# Altium project S7CAS-PLEIADES-CARTE-MERE_P01.PrjPcb (part 2 of 4)

## Sheet S7CAS-PLEIADES-CARTE-MERE_P01_CNA.SchDoc
size Tabloid; DocumentNumber: 6; SheetNumber: 6; SheetTotal: 17; Sheet_Name: CNA; Size: 11x17
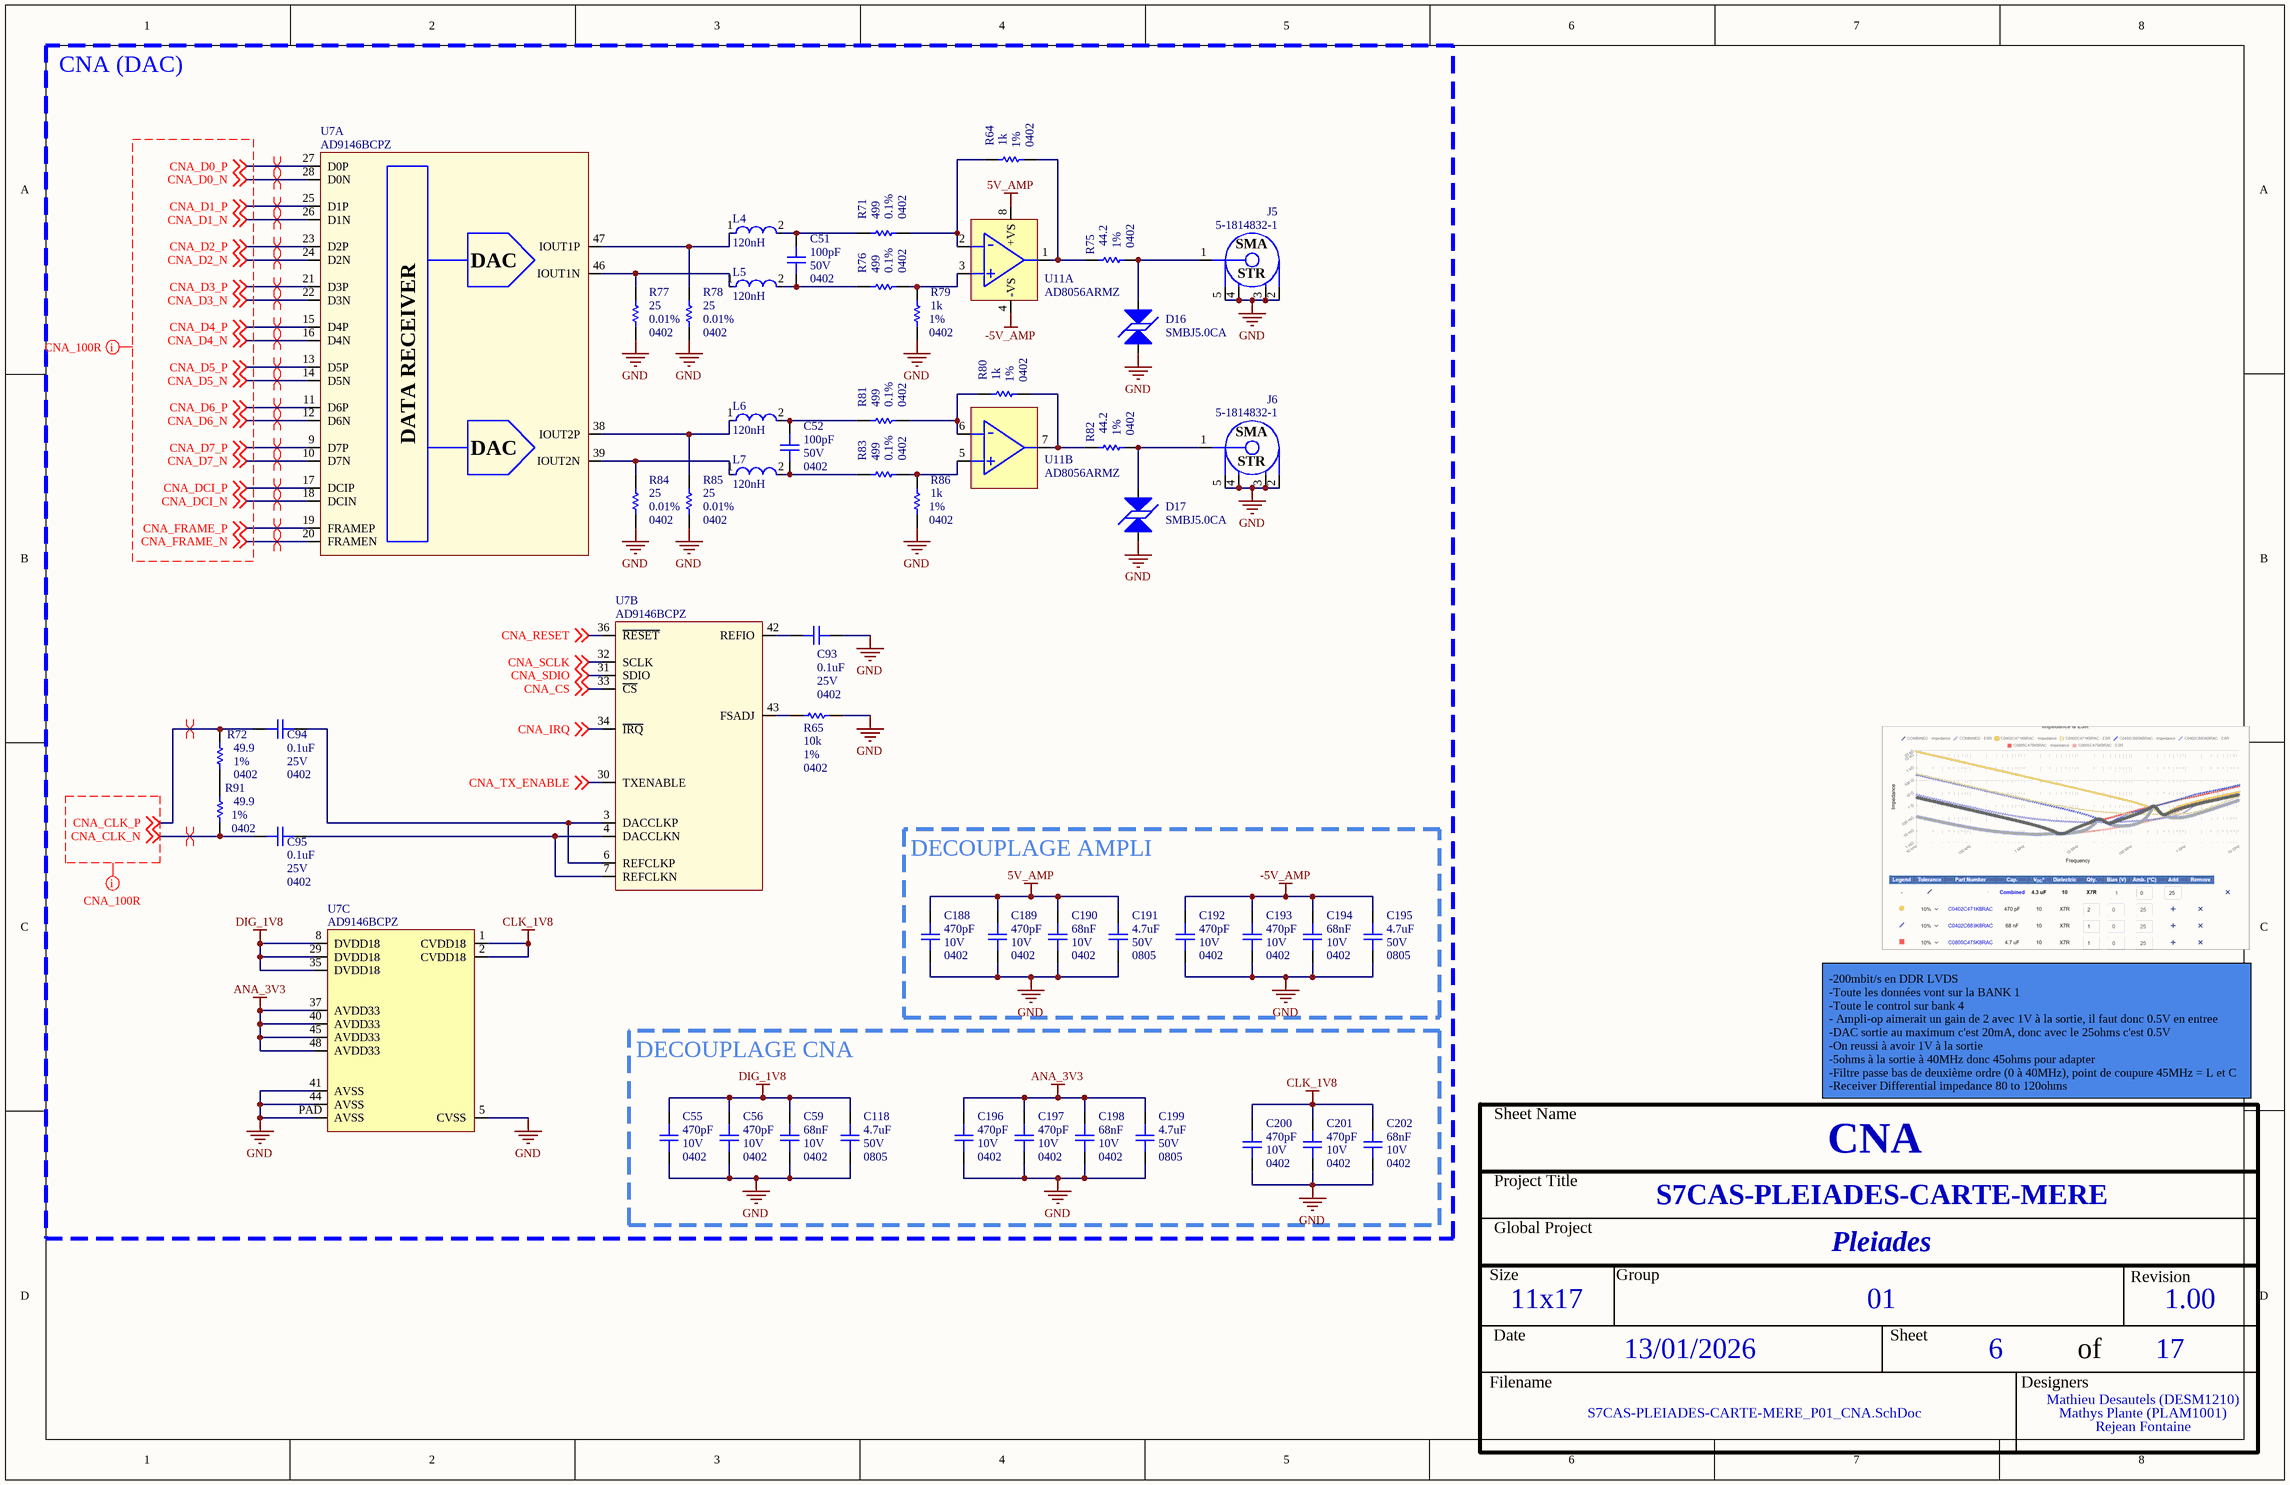
[diagram p5: S7CAS-PLEIADES-CARTE-MERE_P01_CNA.SchDoc]

### Parts
C51  value 100pF  Voltage: 50V  Package: 0402  [CAP_0402]  (hidden comment: CAP - 0402)
C52  value 100pF  Voltage: 50V  Package: 0402  [CAP_0402]  (hidden comment: CAP - 0402)
C55  value 470pF  Voltage: 10V  Package: 0402  [CAP_0402]  (hidden comment: CAP - 0402)
C56  value 470pF  Voltage: 10V  Package: 0402  [CAP_0402]  (hidden comment: CAP - 0402)
C59  value 68nF  Voltage: 10V  Package: 0402  [CAP_0402]  (hidden comment: CAP - 0402)
C93  value 0.1uF  Voltage: 25V  Package: 0402  [CAP_0402]  (hidden comment: CAP - 0402)
C94  value 0.1uF  Voltage: 25V  Package: 0402  [CAP_0402]  (hidden comment: CAP - 0402)
C95  value 0.1uF  Voltage: 25V  Package: 0402  [CAP_0402]  (hidden comment: CAP - 0402)
C118  value 4.7uF  Voltage: 50V  Package: 0805  [CAP_0805]  (hidden comment: CAP - 0805)
C188  value 470pF  Voltage: 10V  Package: 0402  [CAP_0402]  (hidden comment: CAP - 0402)
C189  value 470pF  Voltage: 10V  Package: 0402  [CAP_0402]  (hidden comment: CAP - 0402)
C190  value 68nF  Voltage: 10V  Package: 0402  [CAP_0402]  (hidden comment: CAP - 0402)
C191  value 4.7uF  Voltage: 50V  Package: 0805  [CAP_0805]  (hidden comment: CAP - 0805)
C192  value 470pF  Voltage: 10V  Package: 0402  [CAP_0402]  (hidden comment: CAP - 0402)
C193  value 470pF  Voltage: 10V  Package: 0402  [CAP_0402]  (hidden comment: CAP - 0402)
C194  value 68nF  Voltage: 10V  Package: 0402  [CAP_0402]  (hidden comment: CAP - 0402)
C195  value 4.7uF  Voltage: 50V  Package: 0805  [CAP_0805]  (hidden comment: CAP - 0805)
C196  value 470pF  Voltage: 10V  Package: 0402  [CAP_0402]  (hidden comment: CAP - 0402)
C197  value 470pF  Voltage: 10V  Package: 0402  [CAP_0402]  (hidden comment: CAP - 0402)
C198  value 68nF  Voltage: 10V  Package: 0402  [CAP_0402]  (hidden comment: CAP - 0402)
C199  value 4.7uF  Voltage: 50V  Package: 0805  [CAP_0805]  (hidden comment: CAP - 0805)
C200  value 470pF  Voltage: 10V  Package: 0402  [CAP_0402]  (hidden comment: CAP - 0402)
C201  value 470pF  Voltage: 10V  Package: 0402  [CAP_0402]  (hidden comment: CAP - 0402)
C202  value 68nF  Voltage: 10V  Package: 0402  [CAP_0402]  (hidden comment: CAP - 0402)
D16  SMBJ5.0CA  [TVS_PWR_SMBJ5.0CA]
D17  SMBJ5.0CA  [TVS_PWR_SMBJ5.0CA]
J5  5-1814832-1  [CONN_SMA_5-1814832-1]
J6  5-1814832-1  [CONN_SMA_5-1814832-1]
L4  120nH  [FP-0603HP-MFG]
L5  120nH  [FP-0603HP-MFG]
L6  120nH  [FP-0603HP-MFG]
L7  120nH  [FP-0603HP-MFG]
R64  value 1k  Package: 0402  Precision: 1%  [RES_0402]  (hidden comment: RES - 0402)
R65  value 10k  Package: 0402  Precision: 1%  [RES_0402]  (hidden comment: RES - 0402)
R71  value 499  Package: 0402  Precision: 0.1%  [RES_0402]  (hidden comment: RES - 0402)
R72  value 49.9  Package: 0402  Precision: 1%  [RES_0402]  (hidden comment: RES - 0402)
R75  value 44.2  Package: 0402  Precision: 1%  [RES_0402]  (hidden comment: RES - 0402)
R76  value 499  Package: 0402  Precision: 0.1%  [RES_0402]  (hidden comment: RES - 0402)
R77  value 25  Package: 0402  Precision: 0.01%  [RES_0402]  (hidden comment: RES - 0402)
R78  value 25  Package: 0402  Precision: 0.01%  [RES_0402]  (hidden comment: RES - 0402)
R79  value 1k  Package: 0402  Precision: 1%  [RES_0402]  (hidden comment: RES - 0402)
R80  value 1k  Package: 0402  Precision: 1%  [RES_0402]  (hidden comment: RES - 0402)
R81  value 499  Package: 0402  Precision: 0.1%  [RES_0402]  (hidden comment: RES - 0402)
R82  value 44.2  Package: 0402  Precision: 1%  [RES_0402]  (hidden comment: RES - 0402)
R83  value 499  Package: 0402  Precision: 0.1%  [RES_0402]  (hidden comment: RES - 0402)
R84  value 25  Package: 0402  Precision: 0.01%  [RES_0402]  (hidden comment: RES - 0402)
R85  value 25  Package: 0402  Precision: 0.01%  [RES_0402]  (hidden comment: RES - 0402)
R86  value 1k  Package: 0402  Precision: 1%  [RES_0402]  (hidden comment: RES - 0402)
R91  value 49.9  Package: 0402  Precision: 1%  [RES_0402]  (hidden comment: RES - 0402)
U7  AD9146BCPZ  [DAC_AD9146BCPZ]  (parts A,B,C of 3)
U11  AD8056ARMZ  [OPAMP_AD8056ARMZ]  (parts A,B of 2)

### Blocks framed on the sheet
CNA (DAC): C51 C52 C93-C95 D16 D17 J5 J6 L4-L7 R64 R65 R71 R72 R75-R86 R91 U7 U11
DECOUPLAGE AMPLI: C188-C195
DECOUPLAGE CNA: C55 C56 C59 C118 C196-C202

### Nets
5V_AMP: C188.2 C189.2 C190.2 C191.2 U11.8(+VS)
-5V_AMP: C192.2 C193.2 C194.2 C195.2 U11.4(-VS)
ANA_3V3: C196.2 C197.2 C198.2 C199.2 U7.37(AVDD33) U7.40(AVDD33) U7.45(AVDD33) U7.48(AVDD33)
CLK_1V8: C55.2 C56.2 C59.2 C118.2 C200.2 C201.2 C202.2 U7.1(CVDD18) U7.2(CVDD18) U7.8(DVDD18) U7.29(DVDD18) U7.35(DVDD18)  [also labelled DIG_1V8]
GND: C55.1 C56.1 C59.1 C93.1 C118.1 C188.1 C189.1 C190.1 C191.1 C192.1 C193.1 C194.1 C195.1 C196.1 C197.1 C198.1 C199.1 C200.1 C201.1 C202.1 D16.2 D17.2 J5.2 J5.3 J5.4 J5.5 J6.2 J6.3 J6.4 J6.5 R65.2 R77.1 R78.1 R79.1 R84.1 R85.1 R86.1 U7.5(CVSS) U7.41(AVSS) U7.44(AVSS) U7.PAD(AVSS)
CNA_CLK_N: C95.2 R91.1 ; off-sheet CNA_CLK_N
CNA_CLK_P: C94.2 R72.2 ; off-sheet CNA_CLK_P
CNA_CS: U7.33(~{CS}) ; off-sheet CNA_CS
CNA_D0_N: U7.28(D0N) ; off-sheet CNA_D0_N
CNA_D0_P: U7.27(D0P) ; off-sheet CNA_D0_P
CNA_D1_N: U7.26(D1N) ; off-sheet CNA_D1_N
CNA_D1_P: U7.25(D1P) ; off-sheet CNA_D1_P
CNA_D2_N: U7.24(D2N) ; off-sheet CNA_D2_N
CNA_D2_P: U7.23(D2P) ; off-sheet CNA_D2_P
CNA_D3_N: U7.22(D3N) ; off-sheet CNA_D3_N
CNA_D3_P: U7.21(D3P) ; off-sheet CNA_D3_P
CNA_D4_N: U7.16(D4N) ; off-sheet CNA_D4_N
CNA_D4_P: U7.15(D4P) ; off-sheet CNA_D4_P
CNA_D5_N: U7.14(D5N) ; off-sheet CNA_D5_N
CNA_D5_P: U7.13(D5P) ; off-sheet CNA_D5_P
CNA_D6_N: U7.12(D6N) ; off-sheet CNA_D6_N
CNA_D6_P: U7.11(D6P) ; off-sheet CNA_D6_P
CNA_D7_N: U7.10(D7N) ; off-sheet CNA_D7_N
CNA_D7_P: U7.9(D7P) ; off-sheet CNA_D7_P
CNA_DCI_N: U7.18(DCIN) ; off-sheet CNA_DCI_N
CNA_DCI_P: U7.17(DCIP) ; off-sheet CNA_DCI_P
CNA_FRAME_N: U7.20(FRAMEN) ; off-sheet CNA_FRAME_N
CNA_FRAME_P: U7.19(FRAMEP) ; off-sheet CNA_FRAME_P
CNA_IRQ: U7.34(~{IRQ}) ; off-sheet CNA_IRQ
CNA_RESET: U7.36(~{RESET}) ; off-sheet CNA_RESET
CNA_SCLK: U7.32(SCLK) ; off-sheet CNA_SCLK
CNA_SDIO: U7.31(SDIO) ; off-sheet CNA_SDIO
CNA_TX_ENABLE: U7.30(TXENABLE) ; off-sheet CNA_TX_ENABLE
NetC51_1: C51.1 L5.2 R76.2
NetC51_2: C51.2 L4.2 R71.2
NetC52_1: C52.1 L7.2 R83.2
NetC52_2: C52.2 L6.2 R81.2
NetC93_2: C93.2 U7.42(REFIO)
NetC94_1: C94.1 U7.3(DACCLKP) U7.6(REFCLKP)
NetC95_1: C95.1 U7.4(DACCLKN) U7.7(REFCLKN)
NetD16_1: D16.1 J5.1 R75.1
NetD17_1: D17.1 J6.1 R82.1
NetL4_1: L4.1 R78.2 U7.47(IOUT1P)
NetL5_1: L5.1 R77.2 U7.46(IOUT1N)
NetL6_1: L6.1 R85.2 U7.38(IOUT2P)
NetL7_1: L7.1 R84.2 U7.39(IOUT2N)
NetR64_1: R64.1 R75.2 U11.1(OUT1)
NetR64_2: R64.2 R71.1 U11.2(-IN1)
NetR65_1: R65.1 U7.43(FSADJ)
NetR72_1: R72.1 R91.2
NetR76_1: R76.1 R79.2 U11.3(+IN1)
NetR80_1: R80.1 R82.2 U11.7(OUT2)
NetR80_2: R80.2 R81.1 U11.6(-IN2)
NetR83_1: R83.1 R86.2 U11.5(+IN2)

### Layout directives
net class CNA_100R: CNA_CLK_N, CNA_CLK_P, CNA_D0_N, CNA_D0_P, CNA_D1_N, CNA_D1_P, CNA_D2_N, CNA_D2_P, CNA_D3_N, CNA_D3_P, CNA_D4_N, CNA_D4_P, CNA_D5_N, CNA_D5_P, CNA_D6_N, CNA_D6_P, CNA_D7_N, CNA_D7_P, CNA_DCI_N, CNA_DCI_P, CNA_FRAME_N, CNA_FRAME_P
differential pair: CNA_CLK_N, CNA_CLK_P, CNA_D0_N, CNA_D0_P, CNA_D1_N, CNA_D1_P, CNA_D2_N, CNA_D2_P, CNA_D3_N, CNA_D3_P, CNA_D4_N, CNA_D4_P, CNA_D5_N, CNA_D5_P, CNA_D6_N, CNA_D6_P, CNA_D7_N, CNA_D7_P, CNA_DCI_N, CNA_DCI_P, CNA_FRAME_N, CNA_FRAME_P

### Notes on the sheet
- -200mbit/s en DDR LVDS
  -Toute les données vont sur la BANK 1
  -Toute le control sur bank 4
  - Ampli-op aimerait un gain de 2 avec 1V à la sortie, il faut donc 0.5V en entree
  -DAC sortie au maximum c'est 20mA, donc avec le 25ohms c'est 0.5V
  -On reussi à avoir 1V à la sortie
  -5ohms à la sortie à 40MHz donc 45ohms pour adapter
  -Filtre passe bas de deuxième ordre (0 à 40MHz), point de coupure 45MHz = L et C
  -Receiver Differential impedance 80 to 120ohms
- Sheet Name
- Project Title
- Global Project
- Size
- Group
- Revision
- Date
- Sheet
- of
- Filename
- Designers
- (in symbol CONN_SMA_5-1814832-1) SMA; STR
- (in symbol DAC_AD9146BCPZ, part A) DAC; DATA RECEIVER

### Library data of the parts
C51 C52 = CAP - 0402: 100 pF ±5% 50V Ceramic Capacitor C0G, NP0 0603 (1608 Metric); Mfg Part Number: GRM1885C1H101JA01D; Mfg: Murata Electronics; Current: *; CreatedBy: Jonathan Bouchard; Power: *; Precision: 5%
C55 C56 C188 C189 C192 C193 C196 C197 C200 C201 = CAP - 0402: Mfg Part Number: C0402C471K8RACAUTO; Precision: 10%; Current: *; CreatedBy: Jonathan Bouchard; Power: *
C59 C190 C194 C198 C202 = CAP - 0402: Mfg Part Number: C0402C683K8RAC; Precision: 10%; Current: *; CreatedBy: Jonathan Bouchard; Power: *
C93-C95 = CAP - 0402: 0.1 µF ±10% 25V Ceramic Capacitor X7R 0402 (1005 Metric); Mfg Part Number: CL05B104KA5NNNC; Mfg: Samsung Electro-Mechanics; Current: *; CreatedBy: Jonathan Bouchard; Power: *; Precision: 10%; Part Number #1: CL05B104KA5NNNC
C118 C191 C195 C199 = CAP - 0805: as C81 on sheet S7CAS-PLEIADES-CARTE-MERE_P01_ALIM; Current: *; CreatedBy: Jonathan Bouchard; Power: *; Precision: 10%
D16 D17 = TVS_PWR_SMBJ5.0CA: TVS - BIDIR 5V 9.2V 600W - DO214AA; Manufacturer #1: Littelfuse Inc.; Value: Vbr = 6.4V -  Clamp = 9.2V; Voltage Rating: 5V Standoff; Current Rating: 65.3 A (Ipp); Power Max: 600W (Pppm); GRAMS Lib Spec: 2.8; Magnetic Material: UNKNOWN; Polarized: NO; Tolerance: *; HelpURL: http://www.littelfuse.com/~/media/electronics/datasheets/tvs_diodes/littelfuse_tvs_diode_smbj_datasheet.pdf.pdf; CreatedBy/Date: Jonathan Bouchard - 2019-03-22; VerifiedBy: Nicolas V. (2019-05-06); Temperature: -65°C ~ 150°C (TJ); Package: DO214AA; Manufacturer #2: *; Note: *; Assembly Type: SMD; Part Number #2: *; Part Number #1: SMBJ5.0CA; Supplier 1: Digi-Key; Supplier Part Number 1: SMBJ5.0CALFCT-ND; Cryo: UNKNOWN
J5 J6 = CONN_SMA_5-1814832-1: CONN -  SMA JACK STR 50 OHM - TH; Mfg: TE Connectivity AMP Connectors; Voltage: *; Current: *; Power: *; Mfg Part Number: 5-1814832-1; HelpURL: http://www.te.com/commerce/DocumentDelivery/DDEController?Action=srchrtrv&DocNm=1814832&DocType=Customer+Drawing&DocLang=English; CreatedBy: Jonathan Bouchard; Temperature: -65°C ~ 165°C; Value: *; Precision: *; Package: TH-5; Supplier 1: Digikey; Supplier Part Number 1: A97594-ND
L4-L7 = CMP-11268-000221-1: High Q Ceramic Chip Inductors 3.3nH 5% 0.024Ohm 1900mA 0603; DC Resistance (DCR): 24mR; Test Frequency: 250MHz; Max DC Current: 1.9A; Q Factor: 104; Self Resonant Frequency: 9.6GHz; Inductance: 3.3nH; Core Material: Ceramic; Height: 0.94mm; RoHS Compliant: Yes; Width: 1.09mm; Package Quantity: 2000; Termination: SMD/SMT; Series: 0603HP; Length: 1.75mm; Lead Free: Contains Lead; Packaging: Tape and Reel; Tolerance: 5%; Min Operating Temperature: -40°C; Max Operating Temperature: 125°C; Case/Package: 0603
R64 R79 R80 R86 = RES - 0402: as R108 on sheet S7CAS-PLEIADES-CARTE-MERE_P01_CLOCK; Current: *; CreatedBy: Jonathan Bouchard; Power: 1/10W; Part Number #1: ERJ-2RKF1001X
R65 = RES - 0402: as R53 on sheet S7CAS-PLEIADES-CARTE-MERE_P01_ALIM; Current: *; CreatedBy: Jonathan Bouchard; Power: 1/16W; Part Number #1: RMCF0402FT10K0
R71 R76 R81 R83 = RES - 0402: 499 Ohms ±0.1% 0.063W, 1/16W Chip Resistor 0402 (1005 Metric) Automotive AEC-Q200 Thin Film; Mfg Part Number: ERA-2AEB4990X; Voltage: TBD; Mfg: Panasonic Electronic Components; Current: *; CreatedBy: Jonathan Bouchard; Power: 1/16W
R72 R91 = RES - 0402: 49.9 Ohms ±1% 0.1W, 1/10W Chip Resistor 0402 (1005 Metric) Automotive AEC-Q200 Thick Film; Mfg Part Number: CRCW040249R9FKED; Voltage: 75V; Mfg: Vishay Dale; Current: *; CreatedBy: Jonathan Bouchard; Power: 1/10W; Part Number #1: CRCW040249R9FKED
R75 R82 = RES - 0402: 44.2 Ohms ±1% 0.1W, 1/10W Chip Resistor 0402 (1005 Metric) Automotive AEC-Q200 Thick Film; Mfg Part Number: ERJ-2RKF44R2X; Voltage: TBD; Mfg: Panasonic Electronic Components; Current: *; CreatedBy: Jonathan Bouchard; Power: 1/10W
R77 R78 R84 R85 = RES - 0402: 25 Ohms ±0.1% 0.05W, 1/20W Chip Resistor 0402 (1005 Metric) RF, High Frequency Thin Film; Mfg Part Number: FC0402E25R0BTT0; Voltage: TBD; Mfg: Vishay Dale Thin Film; Current: *; CreatedBy: Jonathan Bouchard; Power: 1/20W
U7 = DAC_AD9146BCPZ: DAC - 16BIT SRL HIGH SPEED - QFN-48; Voltage: 3.13 V ~ 3.47 V / 1.71 V ~ 1.89 V; Mfg: Analog Devices Inc.; Current: *; Power: *; Mfg Part Number: AD9146BCPZ; HelpURL: http://www.analog.com/media/en/technical-documentation/data-sheets/AD9146.PDF; CreatedBy: Jonathan Bouchard; Temperature: -40°C ~ 85°C; Value: *; Precision: 16 Bit; Package: QFN-48; Supplier 1: Digikey; Supplier Part Number 1: AD9146BCPZ-ND
U11 = OPAMP_AD8056ARMZ: OPAMP - VFB 300MHZ - 8MSOP; Voltage: 8 V ~ 12 V, ±4 V ~ 6 V; Current: 60mA; Mfg: Analog Devices; Power: *; Mfg Part Number: AD8056ARMZ; HelpURL: http://www.analog.com/media/en/technical-documentation/data-sheets/AD8055_8056.pdf; CreatedBy: Jonathan Bouchard; Temperature: -40°C ~ 125°C; Value: *; Precision: *; Package: MSOP-8; Supplier 1: Digikey; Supplier Part Number 1: AD8056ARMZ-REEL7CT-ND

## Sheet S7CAS-PLEIADES-CARTE-MERE_P01_CAN.SchDoc
size Tabloid; DocumentNumber: 7; SheetNumber: 7; SheetTotal: 17; Sheet_Name: CAN; Size: 11x17
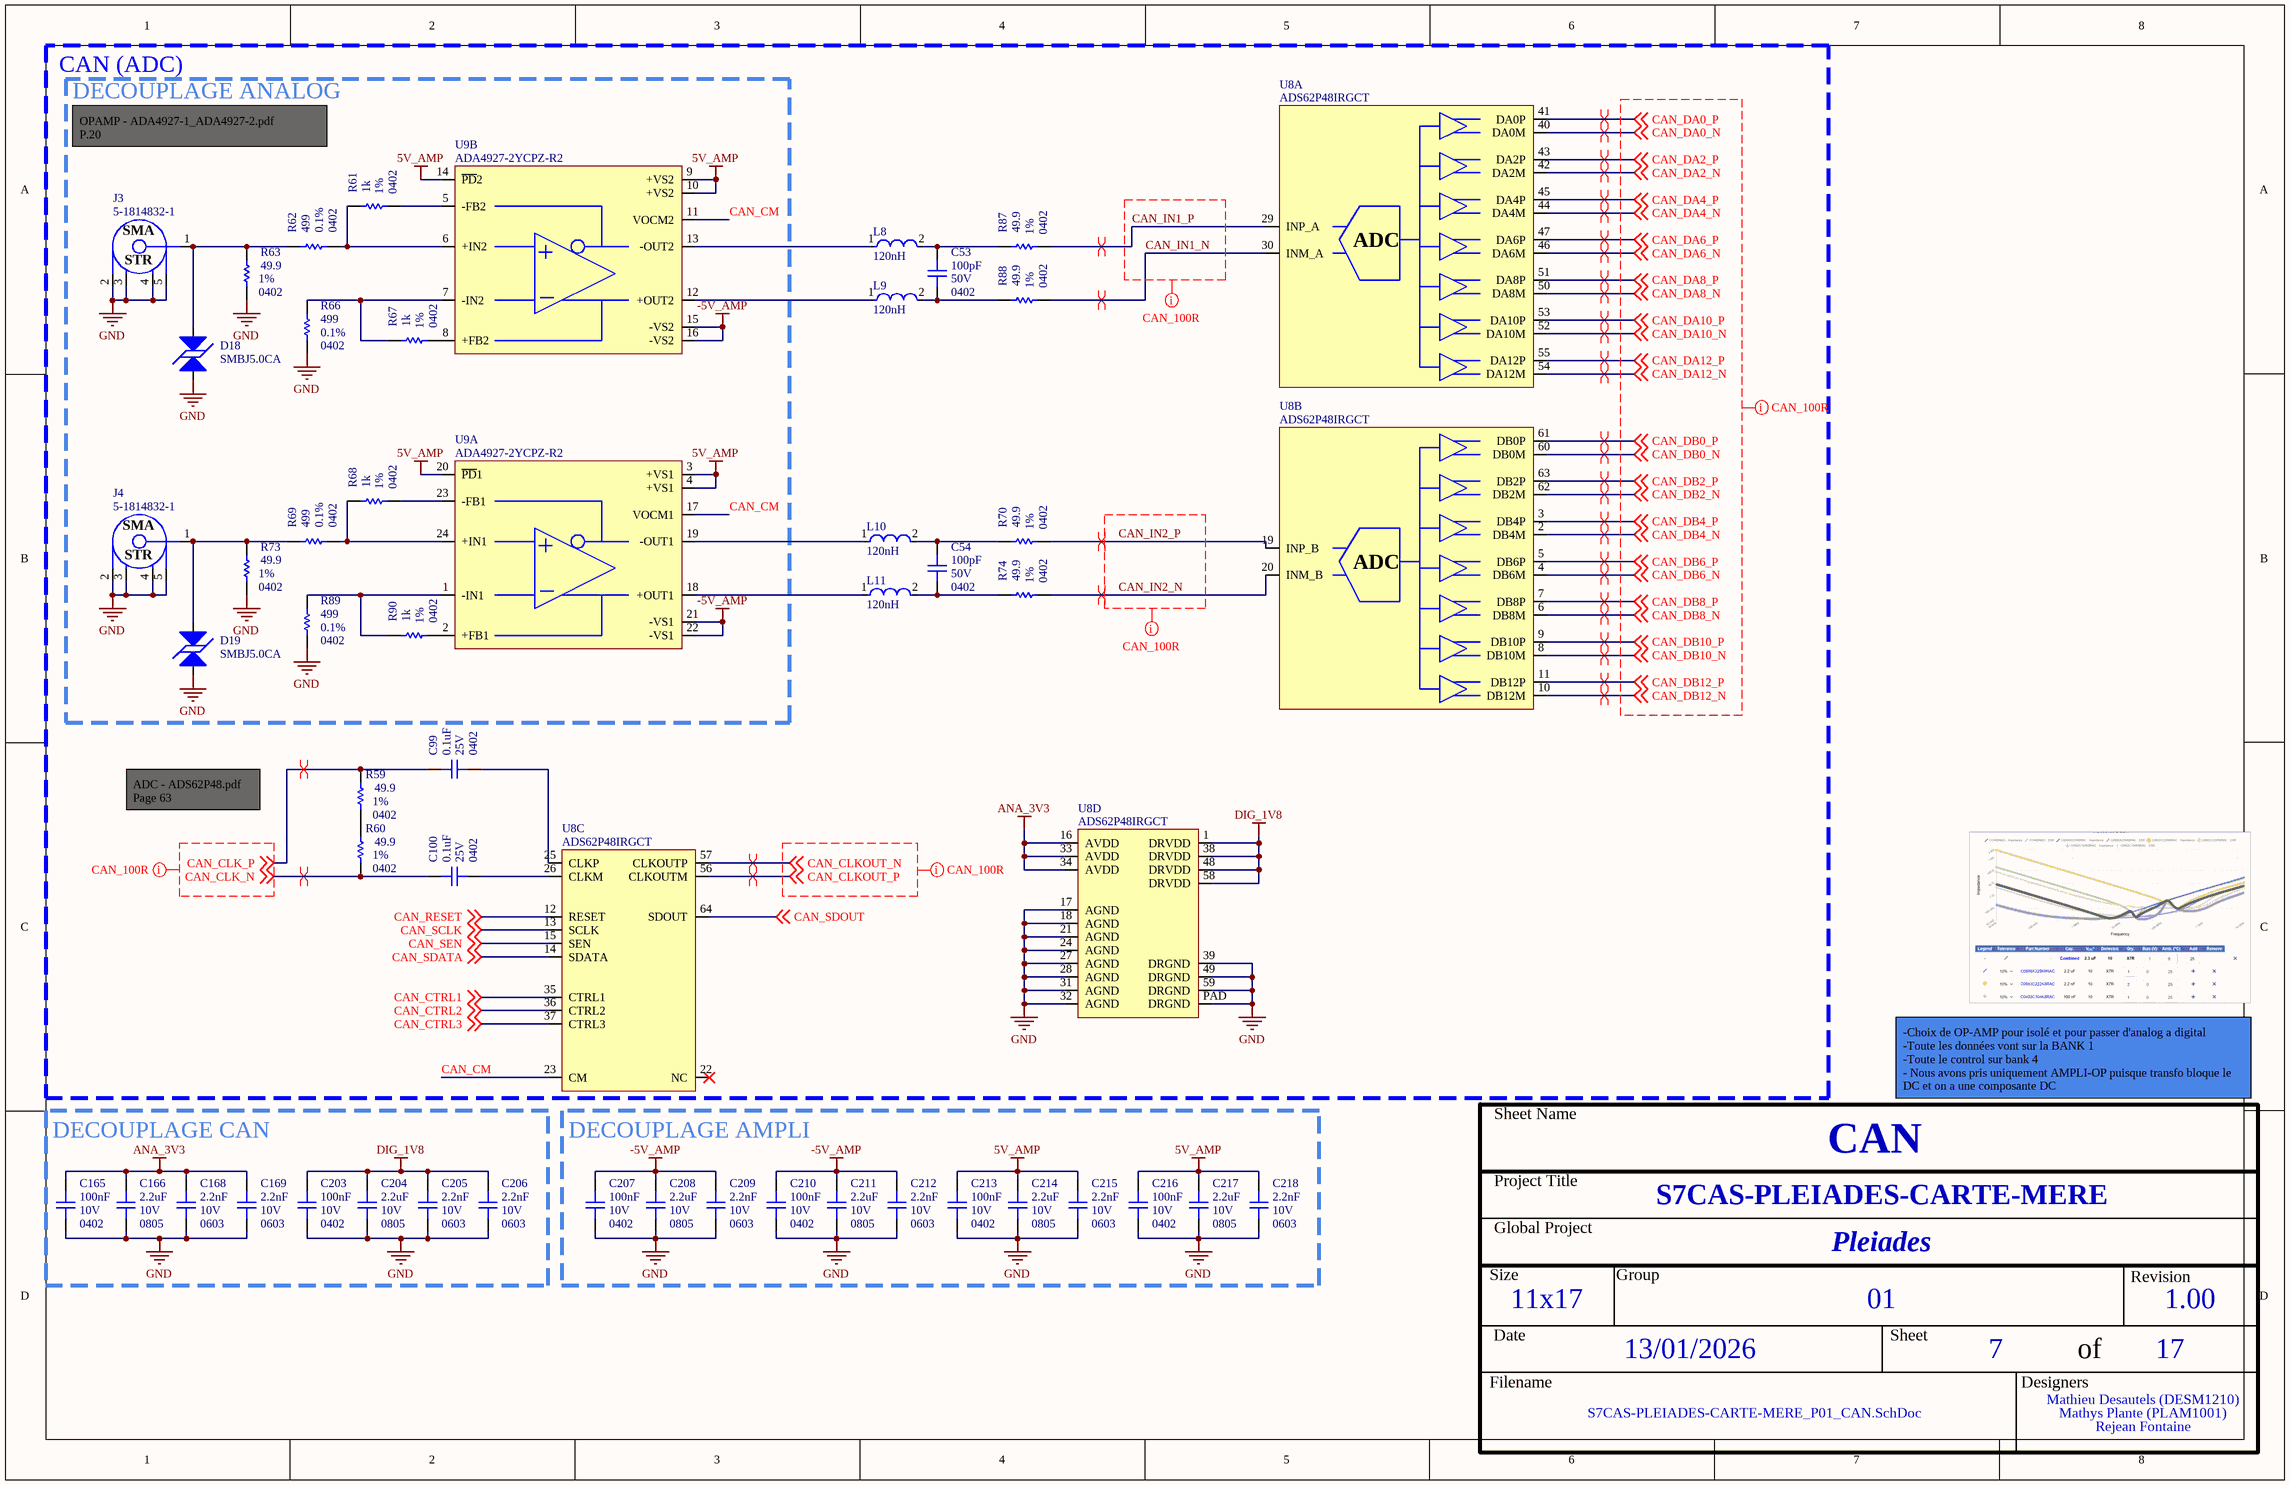
[diagram p6: S7CAS-PLEIADES-CARTE-MERE_P01_CAN.SchDoc]

### Parts
C53  value 100pF  Voltage: 50V  Package: 0402  [CAP_0402]  (hidden comment: CAP - 0402)
C54  value 100pF  Voltage: 50V  Package: 0402  [CAP_0402]  (hidden comment: CAP - 0402)
C99  value 0.1uF  Voltage: 25V  Package: 0402  [CAP_0402]  (hidden comment: CAP - 0402)
C100  value 0.1uF  Voltage: 25V  Package: 0402  [CAP_0402]  (hidden comment: CAP - 0402)
C165  value 100nF  Voltage: 10V  Package: 0402  [CAP_0402]  (hidden comment: CAP - 0402)
C166  value 2.2uF  Voltage: 10V  Package: 0805  [CAP_0805]  (hidden comment: CAP - 0805)
C168  value 2.2nF  Voltage: 10V  Package: 0603  [CAP_0603]  (hidden comment: CAP - 0603)
C169  value 2.2nF  Voltage: 10V  Package: 0603  [CAP_0603]  (hidden comment: CAP - 0603)
C203  value 100nF  Voltage: 10V  Package: 0402  [CAP_0402]  (hidden comment: CAP - 0402)
C204  value 2.2uF  Voltage: 10V  Package: 0805  [CAP_0805]  (hidden comment: CAP - 0805)
C205  value 2.2nF  Voltage: 10V  Package: 0603  [CAP_0603]  (hidden comment: CAP - 0603)
C206  value 2.2nF  Voltage: 10V  Package: 0603  [CAP_0603]  (hidden comment: CAP - 0603)
C207  value 100nF  Voltage: 10V  Package: 0402  [CAP_0402]  (hidden comment: CAP - 0402)
C208  value 2.2uF  Voltage: 10V  Package: 0805  [CAP_0805]  (hidden comment: CAP - 0805)
C209  value 2.2nF  Voltage: 10V  Package: 0603  [CAP_0603]  (hidden comment: CAP - 0603)
C210  value 100nF  Voltage: 10V  Package: 0402  [CAP_0402]  (hidden comment: CAP - 0402)
C211  value 2.2uF  Voltage: 10V  Package: 0805  [CAP_0805]  (hidden comment: CAP - 0805)
C212  value 2.2nF  Voltage: 10V  Package: 0603  [CAP_0603]  (hidden comment: CAP - 0603)
C213  value 100nF  Voltage: 10V  Package: 0402  [CAP_0402]  (hidden comment: CAP - 0402)
C214  value 2.2uF  Voltage: 10V  Package: 0805  [CAP_0805]  (hidden comment: CAP - 0805)
C215  value 2.2nF  Voltage: 10V  Package: 0603  [CAP_0603]  (hidden comment: CAP - 0603)
C216  value 100nF  Voltage: 10V  Package: 0402  [CAP_0402]  (hidden comment: CAP - 0402)
C217  value 2.2uF  Voltage: 10V  Package: 0805  [CAP_0805]  (hidden comment: CAP - 0805)
C218  value 2.2nF  Voltage: 10V  Package: 0603  [CAP_0603]  (hidden comment: CAP - 0603)
D18  SMBJ5.0CA  [TVS_PWR_SMBJ5.0CA]
D19  SMBJ5.0CA  [TVS_PWR_SMBJ5.0CA]
J3  5-1814832-1  [CONN_SMA_5-1814832-1]
J4  5-1814832-1  [CONN_SMA_5-1814832-1]
L8  120nH  [FP-0603HP-MFG]
L9  120nH  [FP-0603HP-MFG]
L10  120nH  [FP-0603HP-MFG]
L11  120nH  [FP-0603HP-MFG]
R59  value 49.9  Package: 0402  Precision: 1%  [RES_0402]  (hidden comment: RES - 0402)
R60  value 49.9  Package: 0402  Precision: 1%  [RES_0402]  (hidden comment: RES - 0402)
R61  value 1k  Package: 0402  Precision: 1%  [RES_0402]  (hidden comment: RES - 0402)
R62  value 499  Package: 0402  Precision: 0.1%  [RES_0402]  (hidden comment: RES - 0402)
R63  value 49.9  Package: 0402  Precision: 1%  [RES_0402]  (hidden comment: RES - 0402)
R66  value 499  Package: 0402  Precision: 0.1%  [RES_0402]  (hidden comment: RES - 0402)
R67  value 1k  Package: 0402  Precision: 1%  [RES_0402]  (hidden comment: RES - 0402)
R68  value 1k  Package: 0402  Precision: 1%  [RES_0402]  (hidden comment: RES - 0402)
R69  value 499  Package: 0402  Precision: 0.1%  [RES_0402]  (hidden comment: RES - 0402)
R70  value 49.9  Package: 0402  Precision: 1%  [RES_0402]  (hidden comment: RES - 0402)
R73  value 49.9  Package: 0402  Precision: 1%  [RES_0402]  (hidden comment: RES - 0402)
R74  value 49.9  Package: 0402  Precision: 1%  [RES_0402]  (hidden comment: RES - 0402)
R87  value 49.9  Package: 0402  Precision: 1%  [RES_0402]  (hidden comment: RES - 0402)
R88  value 49.9  Package: 0402  Precision: 1%  [RES_0402]  (hidden comment: RES - 0402)
R89  value 499  Package: 0402  Precision: 0.1%  [RES_0402]  (hidden comment: RES - 0402)
R90  value 1k  Package: 0402  Precision: 1%  [RES_0402]  (hidden comment: RES - 0402)
U8  ADS62P48IRGCT  [ADC_ADS62P48IRGCT]  (parts A,B,C,D of 4)
U9  ADA4927-2YCPZ-R2  [OPAMP_ADA4927-2YCPZ-R2]  (parts A,B of 2)

### Blocks framed on the sheet
CAN (ADC): C53 C54 C99 C100 L8-L11 R59 R60 R70 R74 R87 R88 U8
DECOUPLAGE ANALOG: D18 D19 J3 J4 R61-R63 R66-R69 R73 R89 R90 U9
DECOUPLAGE CAN: C165 C166 C168 C169 C203-C206
DECOUPLAGE AMPLI: C207-C218

### Nets
5V_AMP: C213.2 C214.2 C215.2 C216.2 C217.2 C218.2 U9.3(+VS1) U9.4(+VS1) U9.9(+VS2) U9.10(+VS2) U9.14(~{PD}2) U9.20(~{PD}1)
-5V_AMP: C207.2 C208.2 C209.2 C210.2 C211.2 C212.2 U9.15(-VS2) U9.16(-VS2) U9.21(-VS1) U9.22(-VS1)
ANA_3V3: C165.2 C166.2 C168.2 C169.2 U8.16(AVDD) U8.33(AVDD) U8.34(AVDD)
DIG_1V8: C203.2 C204.2 C205.2 C206.2 U8.1(DRVDD) U8.38(DRVDD) U8.48(DRVDD) U8.58(DRVDD)  [project net CLK_1V8]
GND: C165.1 C166.1 C168.1 C169.1 C203.1 C204.1 C205.1 C206.1 C207.1 C208.1 C209.1 C210.1 C211.1 C212.1 C213.1 C214.1 C215.1 C216.1 C217.1 C218.1 D18.2 D19.2 J3.2 J3.3 J3.4 J3.5 J4.2 J4.3 J4.4 J4.5 R63.1 R66.1 R73.1 R89.1 U8.17(AGND) U8.18(AGND) U8.21(AGND) U8.24(AGND) U8.27(AGND) U8.28(AGND) U8.31(AGND) U8.32(AGND) U8.39(DRGND) U8.49(DRGND) U8.59(DRGND) U8.PAD(DRGND)
CAN_CLK_N: C100.2 R60.1 ; off-sheet CAN_CLK_N
CAN_CLK_P: C99.2 R59.2 ; off-sheet CAN_CLK_P
CAN_CLKOUT_N: U8.57(CLKOUTP) ; off-sheet CAN_CLKOUT_N
CAN_CLKOUT_P: U8.56(CLKOUTM) ; off-sheet CAN_CLKOUT_P
CAN_CM: U8.23(CM) U9.11(VOCM2) U9.17(VOCM1)
CAN_CTRL1: U8.35(CTRL1) ; off-sheet CAN_CTRL1
CAN_CTRL2: U8.36(CTRL2) ; off-sheet CAN_CTRL2
CAN_CTRL3: U8.37(CTRL3) ; off-sheet CAN_CTRL3
CAN_DA0_N: U8.40(DA0M) ; off-sheet CAN_DA0_N
CAN_DA0_P: U8.41(DA0P) ; off-sheet CAN_DA0_P
CAN_DA2_N: U8.42(DA2M) ; off-sheet CAN_DA2_N
CAN_DA2_P: U8.43(DA2P) ; off-sheet CAN_DA2_P
CAN_DA4_N: U8.44(DA4M) ; off-sheet CAN_DA4_N
CAN_DA4_P: U8.45(DA4P) ; off-sheet CAN_DA4_P
CAN_DA6_N: U8.46(DA6M) ; off-sheet CAN_DA6_N
CAN_DA6_P: U8.47(DA6P) ; off-sheet CAN_DA6_P
CAN_DA8_N: U8.50(DA8M) ; off-sheet CAN_DA8_N
CAN_DA8_P: U8.51(DA8P) ; off-sheet CAN_DA8_P
CAN_DA10_N: U8.52(DA10M) ; off-sheet CAN_DA10_N
CAN_DA10_P: U8.53(DA10P) ; off-sheet CAN_DA10_P
CAN_DA12_N: U8.54(DA12M) ; off-sheet CAN_DA12_N
CAN_DA12_P: U8.55(DA12P) ; off-sheet CAN_DA12_P
CAN_DB0_N: U8.60(DB0M) ; off-sheet CAN_DB0_N
CAN_DB0_P: U8.61(DB0P) ; off-sheet CAN_DB0_P
CAN_DB2_N: U8.62(DB2M) ; off-sheet CAN_DB2_N
CAN_DB2_P: U8.63(DB2P) ; off-sheet CAN_DB2_P
CAN_DB4_N: U8.2(DB4M) ; off-sheet CAN_DB4_N
CAN_DB4_P: U8.3(DB4P) ; off-sheet CAN_DB4_P
CAN_DB6_N: U8.4(DB6M) ; off-sheet CAN_DB6_N
CAN_DB6_P: U8.5(DB6P) ; off-sheet CAN_DB6_P
CAN_DB8_N: U8.6(DB8M) ; off-sheet CAN_DB8_N
CAN_DB8_P: U8.7(DB8P) ; off-sheet CAN_DB8_P
CAN_DB10_N: U8.8(DB10M) ; off-sheet CAN_DB10_N
CAN_DB10_P: U8.9(DB10P) ; off-sheet CAN_DB10_P
CAN_DB12_N: U8.10(DB12M) ; off-sheet CAN_DB12_N
CAN_DB12_P: U8.11(DB12P) ; off-sheet CAN_DB12_P
CAN_IN1_N: R88.1 U8.30(INM_A)
CAN_IN1_P: R87.1 U8.29(INP_A)
CAN_IN2_N: R74.1 U8.20(INM_B)
CAN_IN2_P: R70.1 U8.19(INP_B)
CAN_RESET: U8.12(RESET) ; off-sheet CAN_RESET
CAN_SCLK: U8.13(SCLK) ; off-sheet CAN_SCLK
CAN_SDATA: U8.14(SDATA) ; off-sheet CAN_SDATA
CAN_SDOUT: U8.64(SDOUT) ; off-sheet CAN_SDOUT
CAN_SEN: U8.15(SEN) ; off-sheet CAN_SEN
NetC53_1: C53.1 L9.2 R88.2
NetC53_2: C53.2 L8.2 R87.2
NetC54_1: C54.1 L11.2 R74.2
NetC54_2: C54.2 L10.2 R70.2
NetC99_1: C99.1 U8.25(CLKP)
NetC100_1: C100.1 U8.26(CLKM)
NetD18_1: D18.1 J3.1 R62.2 R63.2
NetD19_1: D19.1 J4.1 R69.2 R73.2
NetL8_1: L8.1 U9.13(-OUT2)
NetL9_1: L9.1 U9.12(+OUT2)
NetL10_1: L10.1 U9.19(-OUT1)
NetL11_1: L11.1 U9.18(+OUT1)
NetR59_1: R59.1 R60.2
NetR61_1: R61.1 U9.5(-FB2)
NetR61_2: R61.2 R62.1 U9.6(+IN2)
NetR66_2: R66.2 R67.2 U9.7(-IN2)
NetR67_1: R67.1 U9.8(+FB2)
NetR68_1: R68.1 U9.23(-FB1)
NetR68_2: R68.2 R69.1 U9.24(+IN1)
NetR89_2: R89.2 R90.2 U9.1(-IN1)
NetR90_1: R90.1 U9.2(+FB1)

Not connected (* = marked no-connect by the designer): U8 22(NC)*

### Layout directives
net class CAN_100R: CAN_CLK_N, CAN_CLK_P, CAN_CLKOUT_N, CAN_CLKOUT_P, CAN_DA0_N, CAN_DA0_P, CAN_DA2_N, CAN_DA2_P, CAN_DA4_N, CAN_DA4_P, CAN_DA6_N, CAN_DA6_P, CAN_DA8_N, CAN_DA8_P, CAN_DA10_N, CAN_DA10_P, CAN_DA12_N, CAN_DA12_P, CAN_DB0_N, CAN_DB0_P, CAN_DB2_N, CAN_DB2_P, CAN_DB4_N, CAN_DB4_P, CAN_DB6_N, CAN_DB6_P, CAN_DB8_N, CAN_DB8_P, CAN_DB10_N, CAN_DB10_P, CAN_DB12_N, CAN_DB12_P, CAN_IN1_N, CAN_IN1_P, CAN_IN2_N, CAN_IN2_P
differential pair: CAN_CLK_N, CAN_CLK_P, CAN_CLKOUT_N, CAN_CLKOUT_P, CAN_DA0_N, CAN_DA0_P, CAN_DA2_N, CAN_DA2_P, CAN_DA4_N, CAN_DA4_P, CAN_DA6_N, CAN_DA6_P, CAN_DA8_N, CAN_DA8_P, CAN_DA10_N, CAN_DA10_P, CAN_DA12_N, CAN_DA12_P, CAN_DB0_N, CAN_DB0_P, CAN_DB2_N, CAN_DB2_P, CAN_DB4_N, CAN_DB4_P, CAN_DB6_N, CAN_DB6_P, CAN_DB8_N, CAN_DB8_P, CAN_DB10_N, CAN_DB10_P, CAN_DB12_N, CAN_DB12_P, CAN_IN1_N, CAN_IN1_P, CAN_IN2_N, CAN_IN2_P

### Notes on the sheet
- OPAMP - ADA4927-1_ADA4927-2.pdf
  P.20
- ADC - ADS62P48.pdf
  Page 63
- -Choix de OP-AMP pour isolé et pour passer d'analog a digital
  -Toute les données vont sur la BANK 1
  -Toute le control sur bank 4
  - Nous avons pris uniquement AMPLI-OP puisque transfo bloque le DC et on a une composante DC
- Sheet Name
- Project Title
- Global Project
- Size
- Group
- Revision
- Date
- Sheet
- of
- Filename
- Designers
- (in symbol ADC_ADS62P48IRGCT, part A) ADC
- (in symbol ADC_ADS62P48IRGCT, part B) ADC
- (in symbol CONN_SMA_5-1814832-1) SMA; STR

### Library data of the parts
C53 C54 = CAP - 0402: 100 pF ±5% 50V Ceramic Capacitor C0G, NP0 0603 (1608 Metric); Mfg Part Number: GRM1885C1H101JA01D; Mfg: Murata Electronics; Current: *; CreatedBy: Jonathan Bouchard; Power: *; Precision: 5%
C99 C100 = CAP - 0402: 0.1 µF ±10% 25V Ceramic Capacitor X7R 0402 (1005 Metric); Mfg Part Number: CL05B104KA5NNNC; Mfg: Samsung Electro-Mechanics; Current: *; CreatedBy: Jonathan Bouchard; Power: *; Precision: 10%; Part Number #1: CL05B104KA5NNNC
C165 C203 C207 C210 C213 C216 = CAP - 0402: Mfg Part Number: C0402C104K8RAC; Precision: 10%; Current: *; CreatedBy: Jonathan Bouchard; Power: *
C166 C204 C208 C211 C214 C217 = CAP - 0805: Mfg Part Number: C0805C225K8RAC; Precision: 10%; Current: *; CreatedBy: Jonathan Bouchard; Power: *
C168 C169 C205 C206 C209 C212 C215 C218 = CAP - 0603: Mfg Part Number: C0603X222K8RAC; Precision: 10%; Current: *; CreatedBy: Jonathan Bouchard; Power: *
D18 D19 = TVS_PWR_SMBJ5.0CA: TVS - BIDIR 5V 9.2V 600W - DO214AA; Manufacturer #1: Littelfuse Inc.; Value: Vbr = 6.4V -  Clamp = 9.2V; Voltage Rating: 5V Standoff; Current Rating: 65.3 A (Ipp); Power Max: 600W (Pppm); GRAMS Lib Spec: 2.8; Magnetic Material: UNKNOWN; Polarized: NO; Tolerance: *; HelpURL: http://www.littelfuse.com/~/media/electronics/datasheets/tvs_diodes/littelfuse_tvs_diode_smbj_datasheet.pdf.pdf; CreatedBy/Date: Jonathan Bouchard - 2019-03-22; VerifiedBy: Nicolas V. (2019-05-06); Temperature: -65°C ~ 150°C (TJ); Package: DO214AA; Manufacturer #2: *; Note: *; Assembly Type: SMD; Part Number #2: *; Part Number #1: SMBJ5.0CA; Supplier 1: Digi-Key; Supplier Part Number 1: SMBJ5.0CALFCT-ND; Cryo: UNKNOWN
J3 J4 = CONN_SMA_5-1814832-1: CONN -  SMA JACK STR 50 OHM - TH; Mfg: TE Connectivity AMP Connectors; Voltage: *; Current: *; Power: *; Mfg Part Number: 5-1814832-1; HelpURL: http://www.te.com/commerce/DocumentDelivery/DDEController?Action=srchrtrv&DocNm=1814832&DocType=Customer+Drawing&DocLang=English; CreatedBy: Jonathan Bouchard; Temperature: -65°C ~ 165°C; Value: *; Precision: *; Package: TH-5; Supplier 1: Digikey; Supplier Part Number 1: A97594-ND
L8-L11 = CMP-11268-000221-1: High Q Ceramic Chip Inductors 3.3nH 5% 0.024Ohm 1900mA 0603; DC Resistance (DCR): 24mR; Test Frequency: 250MHz; Max DC Current: 1.9A; Q Factor: 104; Self Resonant Frequency: 9.6GHz; Inductance: 3.3nH; Core Material: Ceramic; Height: 0.94mm; RoHS Compliant: Yes; Width: 1.09mm; Package Quantity: 2000; Termination: SMD/SMT; Series: 0603HP; Length: 1.75mm; Lead Free: Contains Lead; Packaging: Tape and Reel; Tolerance: 5%; Min Operating Temperature: -40°C; Max Operating Temperature: 125°C; Case/Package: 0603
R59 R60 R63 R70 R73 R74 R87 R88 = RES - 0402: 49.9 Ohms ±1% 0.1W, 1/10W Chip Resistor 0402 (1005 Metric) Automotive AEC-Q200 Thick Film; Mfg Part Number: CRCW040249R9FKED; Voltage: 75V; Mfg: Vishay Dale; Current: *; CreatedBy: Jonathan Bouchard; Power: 1/10W; Part Number #1: CRCW040249R9FKED
R61 R67 R68 R90 = RES - 0402: 1 kOhms ±1% 0.1W, 1/10W Chip Resistor 0402 (1005 Metric) Automotive AEC-Q200 Thick Film; Mfg Part Number: ERJ-2RKF1001X; Voltage: 50V; Mfg: Panasonic Electronic Components; Current: *; CreatedBy: Jonathan Bouchard; Power: 1/10W; Part Number #1: ERJ-2RKF1001X
R62 R66 R69 R89 = RES - 0402: 499 Ohms ±0.1% 0.063W, 1/16W Chip Resistor 0402 (1005 Metric) Automotive AEC-Q200 Thin Film; Mfg Part Number: ERA-2AEB4990X; Voltage: TBD; Mfg: Panasonic Electronic Components; Current: *; CreatedBy: Jonathan Bouchard; Power: 1/16W
U8 = ADC_ADS62P48IRGCT: ADC - 14 BIT 210MSPS SUAL - VQFN-64; Voltage: 3.15 V ~ 3.6 V / 1.7 V ~ 1.9 V; Mfg: Texas Instruments; Precision: 14 Bit; Current: *; Power: *; Mfg Part Number: ADS62P48IRGCT; HelpURL: http://www.ti.com/lit/ds/symlink/ads62p48.pdf; CreatedBy: Jonathan Bouchard; Temperature: -40°C ~ 85°C; Value: *; Package: VQFN-64; Supplier 1: Digikey; Supplier Part Number 1: 296-24611-1-ND
U9 = OPAMP_ADA4927-2YCPZ-R2: OPAMP - CFA 2.3GHZ - QFN-24; Voltage: 4.5 V ~ 11 V, ±2.25 V ~ 5.5 V; Current: 65mA; Mfg: Analog Devices; Power: *; Mfg Part Number: ADA4927-2YCPZ-R2; HelpURL: http://www.analog.com/media/en/technical-documentation/data-sheets/ADA4927-1_4927-2.pdf; CreatedBy: Jonathan Bouchard; Temperature: -40°C ~ 105°C; Value: *; Precision: *; Package: QFN-24; Supplier 1: Digikey; Supplier Part Number 1: ADA4927-2YCPZ-R2CT-ND

## Sheet S7CAS-PLEIADES-CARTE-MERE_P01_DDR3.SchDoc
size Tabloid; DocumentNumber: 8; SheetNumber: 8; SheetTotal: 17; Sheet_Name: DDR3; Size: 11x17
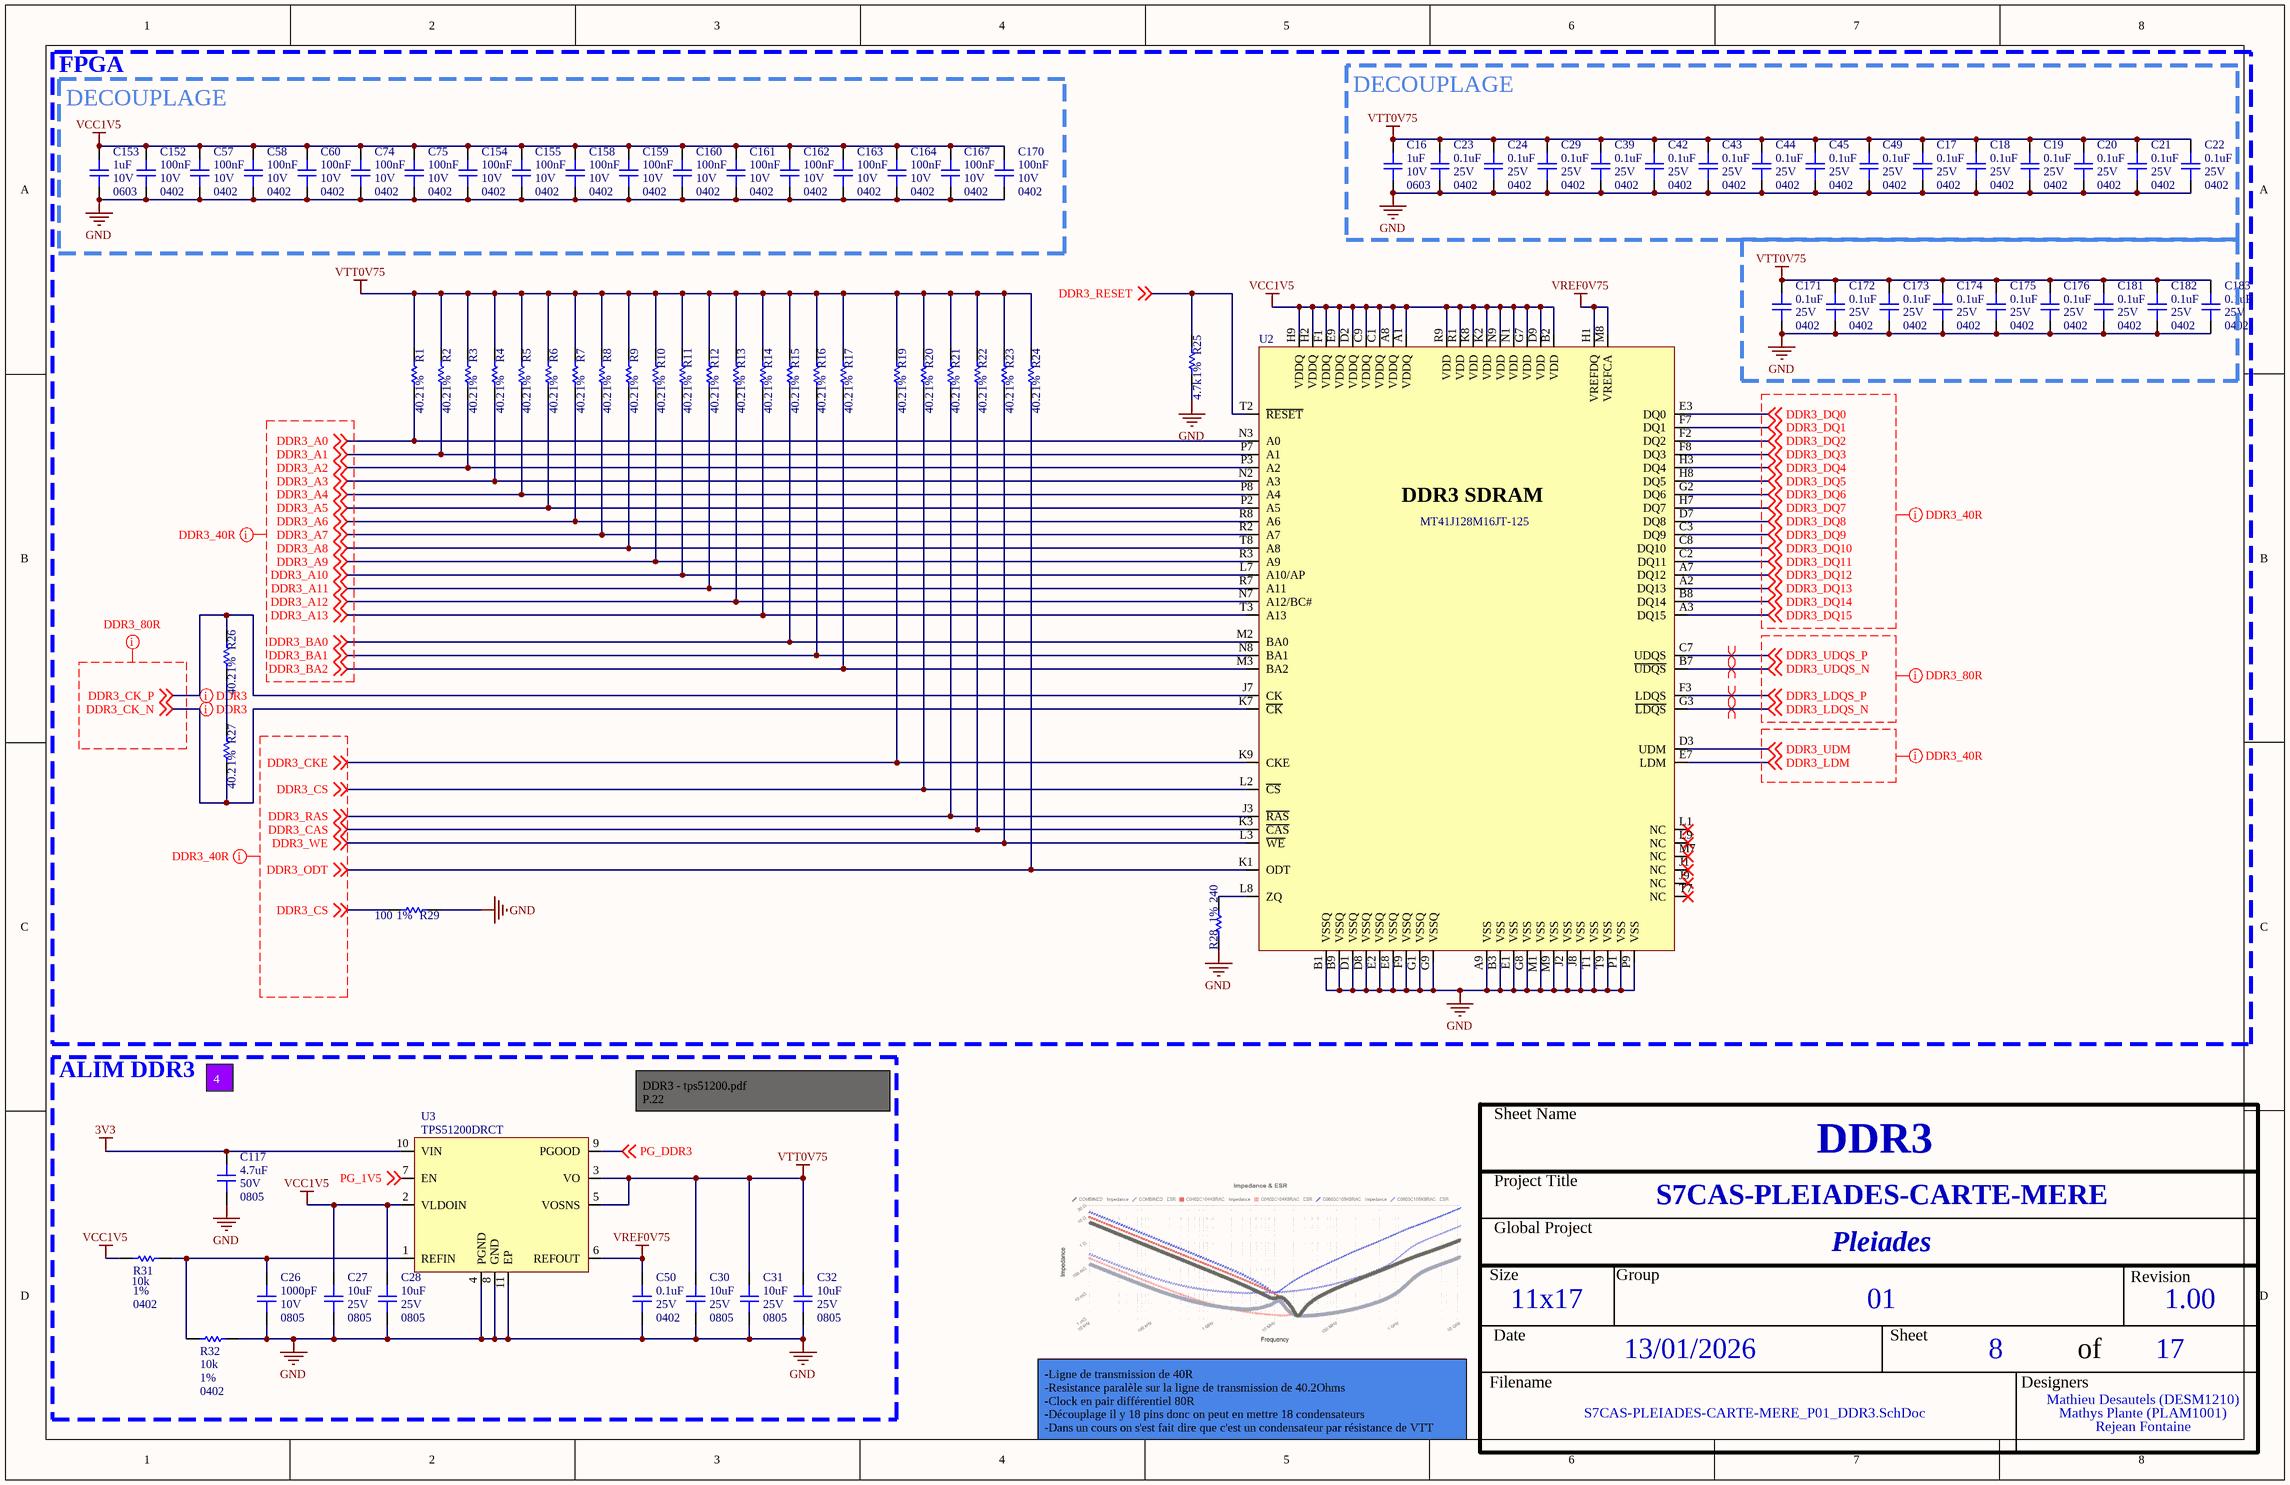
[diagram p7: S7CAS-PLEIADES-CARTE-MERE_P01_DDR3.SchDoc]

### Parts
C16  value 1uF  Voltage: 10V  Package: 0603  [CAP_0603]  (hidden comment: CAP - 0603)
C17  value 0.1uF  Voltage: 25V  Package: 0402  [CAP_0402]  (hidden comment: CAP - 0402)
C18  value 0.1uF  Voltage: 25V  Package: 0402  [CAP_0402]  (hidden comment: CAP - 0402)
C19  value 0.1uF  Voltage: 25V  Package: 0402  [CAP_0402]  (hidden comment: CAP - 0402)
C20  value 0.1uF  Voltage: 25V  Package: 0402  [CAP_0402]  (hidden comment: CAP - 0402)
C21  value 0.1uF  Voltage: 25V  Package: 0402  [CAP_0402]  (hidden comment: CAP - 0402)
C22  value 0.1uF  Voltage: 25V  Package: 0402  [CAP_0402]  (hidden comment: CAP - 0402)
C23  value 0.1uF  Voltage: 25V  Package: 0402  [CAP_0402]  (hidden comment: CAP - 0402)
C24  value 0.1uF  Voltage: 25V  Package: 0402  [CAP_0402]  (hidden comment: CAP - 0402)
C26  value 1000pF  Voltage: 10V  Package: 0805  [CAP_0805]  (hidden comment: CAP - 0805)
C27  value 10uF  Voltage: 25V  Package: 0805  [CAP_0805]  (hidden comment: CAP - 0805)
C28  value 10uF  Voltage: 25V  Package: 0805  [CAP_0805]  (hidden comment: CAP - 0805)
C29  value 0.1uF  Voltage: 25V  Package: 0402  [CAP_0402]  (hidden comment: CAP - 0402)
C30  value 10uF  Voltage: 25V  Package: 0805  [CAP_0805]  (hidden comment: CAP - 0805)
C31  value 10uF  Voltage: 25V  Package: 0805  [CAP_0805]  (hidden comment: CAP - 0805)
C32  value 10uF  Voltage: 25V  Package: 0805  [CAP_0805]  (hidden comment: CAP - 0805)
C39  value 0.1uF  Voltage: 25V  Package: 0402  [CAP_0402]  (hidden comment: CAP - 0402)
C42  value 0.1uF  Voltage: 25V  Package: 0402  [CAP_0402]  (hidden comment: CAP - 0402)
C43  value 0.1uF  Voltage: 25V  Package: 0402  [CAP_0402]  (hidden comment: CAP - 0402)
C44  value 0.1uF  Voltage: 25V  Package: 0402  [CAP_0402]  (hidden comment: CAP - 0402)
C45  value 0.1uF  Voltage: 25V  Package: 0402  [CAP_0402]  (hidden comment: CAP - 0402)
C49  value 0.1uF  Voltage: 25V  Package: 0402  [CAP_0402]  (hidden comment: CAP - 0402)
C50  value 0.1uF  Voltage: 25V  Package: 0402  [CAP_0402]  (hidden comment: CAP - 0402)
C57  value 100nF  Voltage: 10V  Package: 0402  [CAP_0402]  (hidden comment: CAP - 0402)
C58  value 100nF  Voltage: 10V  Package: 0402  [CAP_0402]  (hidden comment: CAP - 0402)
C60  value 100nF  Voltage: 10V  Package: 0402  [CAP_0402]  (hidden comment: CAP - 0402)
C74  value 100nF  Voltage: 10V  Package: 0402  [CAP_0402]  (hidden comment: CAP - 0402)
C75  value 100nF  Voltage: 10V  Package: 0402  [CAP_0402]  (hidden comment: CAP - 0402)
C117  value 4.7uF  Voltage: 50V  Package: 0805  [CAP_0805]  (hidden comment: CAP - 0805)
C152  value 100nF  Voltage: 10V  Package: 0402  [CAP_0402]  (hidden comment: CAP - 0402)
C153  value 1uF  Voltage: 10V  Package: 0603  [CAP_0603]  (hidden comment: CAP - 0603)
C154  value 100nF  Voltage: 10V  Package: 0402  [CAP_0402]  (hidden comment: CAP - 0402)
C155  value 100nF  Voltage: 10V  Package: 0402  [CAP_0402]  (hidden comment: CAP - 0402)
C158  value 100nF  Voltage: 10V  Package: 0402  [CAP_0402]  (hidden comment: CAP - 0402)
C159  value 100nF  Voltage: 10V  Package: 0402  [CAP_0402]  (hidden comment: CAP - 0402)
C160  value 100nF  Voltage: 10V  Package: 0402  [CAP_0402]  (hidden comment: CAP - 0402)
C161  value 100nF  Voltage: 10V  Package: 0402  [CAP_0402]  (hidden comment: CAP - 0402)
C162  value 100nF  Voltage: 10V  Package: 0402  [CAP_0402]  (hidden comment: CAP - 0402)
C163  value 100nF  Voltage: 10V  Package: 0402  [CAP_0402]  (hidden comment: CAP - 0402)
C164  value 100nF  Voltage: 10V  Package: 0402  [CAP_0402]  (hidden comment: CAP - 0402)
C167  value 100nF  Voltage: 10V  Package: 0402  [CAP_0402]  (hidden comment: CAP - 0402)
C170  value 100nF  Voltage: 10V  Package: 0402  [CAP_0402]  (hidden comment: CAP - 0402)
C171  value 0.1uF  Voltage: 25V  Package: 0402  [CAP_0402]  (hidden comment: CAP - 0402)
C172  value 0.1uF  Voltage: 25V  Package: 0402  [CAP_0402]  (hidden comment: CAP - 0402)
C173  value 0.1uF  Voltage: 25V  Package: 0402  [CAP_0402]  (hidden comment: CAP - 0402)
C174  value 0.1uF  Voltage: 25V  Package: 0402  [CAP_0402]  (hidden comment: CAP - 0402)
C175  value 0.1uF  Voltage: 25V  Package: 0402  [CAP_0402]  (hidden comment: CAP - 0402)
C176  value 0.1uF  Voltage: 25V  Package: 0402  [CAP_0402]  (hidden comment: CAP - 0402)
C181  value 0.1uF  Voltage: 25V  Package: 0402  [CAP_0402]  (hidden comment: CAP - 0402)
C182  value 0.1uF  Voltage: 25V  Package: 0402  [CAP_0402]  (hidden comment: CAP - 0402)
C183  value 0.1uF  Voltage: 25V  Package: 0402  [CAP_0402]  (hidden comment: CAP - 0402)
R1  value 40.2  Precision: 1%  [RES_0402]  (hidden comment: RES - 0402)
R2  value 40.2  Precision: 1%  [RES_0402]  (hidden comment: RES - 0402)
R3  value 40.2  Precision: 1%  [RES_0402]  (hidden comment: RES - 0402)
R4  value 40.2  Precision: 1%  [RES_0402]  (hidden comment: RES - 0402)
R5  value 40.2  Precision: 1%  [RES_0402]  (hidden comment: RES - 0402)
R6  value 40.2  Precision: 1%  [RES_0402]  (hidden comment: RES - 0402)
R7  value 40.2  Precision: 1%  [RES_0402]  (hidden comment: RES - 0402)
R8  value 40.2  Precision: 1%  [RES_0402]  (hidden comment: RES - 0402)
R9  value 40.2  Precision: 1%  [RES_0402]  (hidden comment: RES - 0402)
R10  value 40.2  Precision: 1%  [RES_0402]  (hidden comment: RES - 0402)
R11  value 40.2  Precision: 1%  [RES_0402]  (hidden comment: RES - 0402)
R12  value 40.2  Precision: 1%  [RES_0402]  (hidden comment: RES - 0402)
R13  value 40.2  Precision: 1%  [RES_0402]  (hidden comment: RES - 0402)
R14  value 40.2  Precision: 1%  [RES_0402]  (hidden comment: RES - 0402)
R15  value 40.2  Precision: 1%  [RES_0402]  (hidden comment: RES - 0402)
R16  value 40.2  Precision: 1%  [RES_0402]  (hidden comment: RES - 0402)
R17  value 40.2  Precision: 1%  [RES_0402]  (hidden comment: RES - 0402)
R19  value 40.2  Precision: 1%  [RES_0402]  (hidden comment: RES - 0402)
R20  value 40.2  Precision: 1%  [RES_0402]  (hidden comment: RES - 0402)
R21  value 40.2  Precision: 1%  [RES_0402]  (hidden comment: RES - 0402)
R22  value 40.2  Precision: 1%  [RES_0402]  (hidden comment: RES - 0402)
R23  value 40.2  Precision: 1%  [RES_0402]  (hidden comment: RES - 0402)
R24  value 40.2  Precision: 1%  [RES_0402]  (hidden comment: RES - 0402)
R25  value 4.7k  Precision: 1%  [RES_0402]  (hidden comment: RES - 0402)
R26  value 40.2  Precision: 1%  [RES_0402]  (hidden comment: RES - 0402)
R27  value 40.2  Precision: 1%  [RES_0402]  (hidden comment: RES - 0402)
R28  value 240  Precision: 1%  [RES_0402]  (hidden comment: RES - 0402)
R29  value 100  Precision: 1%  [RES_0402]  (hidden comment: RES - 0402)
R31  value 10k  Package: 0402  Precision: 1%  [RES_0402]  (hidden comment: RES - 0402)
R32  value 10k  Package: 0402  Precision: 1%  [RES_0402]  (hidden comment: RES - 0402)
U2  MT41J128M16JT-125  [MEM_DDR3_MT41J128M16JT-125]
U3  TPS51200DRCT  [REG_PMIC_TPS51200DRCT]

### Blocks framed on the sheet
DECOUPLAGE: C16-C24 C29 C39 C42-C45 C49
ALIM DDR3: C26-C28 C30-C32 C50 C117 R31 R32 U3

### Nets
3V3: C117.2 U3.10(VIN)  [project net VDD_3V3]
GND: C16.1 C17.1 C18.1 C19.1 C20.1 C21.1 C22.1 C23.1 C24.1 C26.1 C27.1 C28.1 C29.1 C30.1 C31.1 C32.1 C39.1 C42.1 C43.1 C44.1 C45.1 C49.1 C50.1 C57.1 C58.1 C60.1 C74.1 C75.1 C117.1 C152.1 C153.1 C154.1 C155.1 C158.1 C159.1 C160.1 C161.1 C162.1 C163.1 C164.1 C167.1 C170.1 C171.1 C172.1 C173.1 C174.1 C175.1 C176.1 C181.1 C182.1 C183.1 R25.1 R28.2 R29.2 R32.2 U2.A9(VSS) U2.B1(VSSQ) U2.B3(VSS) U2.B9(VSSQ) U2.D1(VSSQ) U2.D8(VSSQ) U2.E1(VSS) U2.E2(VSSQ) U2.E8(VSSQ) U2.F9(VSSQ) U2.G1(VSSQ) U2.G8(VSS) U2.G9(VSSQ) U2.J2(VSS) U2.J8(VSS) U2.M1(VSS) U2.M9(VSS) U2.P1(VSS) U2.P9(VSS) U2.T1(VSS) U2.T9(VSS) U3.4(PGND) U3.8(GND) U3.11(EP)
VCC1V5: C27.2 C28.2 C57.2 C58.2 C60.2 C74.2 C75.2 C152.2 C153.2 C154.2 C155.2 C158.2 C159.2 C160.2 C161.2 C162.2 C163.2 C164.2 C167.2 C170.2 R31.1 U2.A1(VDDQ) U2.A8(VDDQ) U2.B2(VDD) U2.C1(VDDQ) U2.C9(VDDQ) U2.D2(VDDQ) U2.D9(VDD) U2.E9(VDDQ) U2.F1(VDDQ) U2.G7(VDD) U2.H2(VDDQ) U2.H9(VDDQ) U2.K2(VDD) U2.K8(VDD) U2.N1(VDD) U2.N9(VDD) U2.R1(VDD) U2.R9(VDD) U3.2(VLDOIN)
VREF0V75: C50.2 U2.H1(VREFDQ) U2.M8(VREFCA) U3.6(REFOUT)
VTT0V75: C16.2 C17.2 C18.2 C19.2 C20.2 C21.2 C22.2 C23.2 C24.2 C29.2 C30.2 C31.2 C32.2 C39.2 C42.2 C43.2 C44.2 C45.2 C49.2 C171.2 C172.2 C173.2 C174.2 C175.2 C176.2 C181.2 C182.2 C183.2 R1.2 R2.2 R3.2 R4.2 R5.2 R6.2 R7.2 R8.2 R9.2 R10.2 R11.2 R12.2 R13.2 R14.2 R15.2 R16.2 R17.2 R19.2 R20.2 R21.2 R22.2 R23.2 R24.2 U3.3(VO) U3.5(VOSNS)
DDR3_A0: R1.1 U2.N3(A0) ; off-sheet DDR3_A0
DDR3_A1: R2.1 U2.P7(A1) ; off-sheet DDR3_A1
DDR3_A2: R3.1 U2.P3(A2) ; off-sheet DDR3_A2
DDR3_A3: R4.1 U2.N2(A3) ; off-sheet DDR3_A3
DDR3_A4: R5.1 U2.P8(A4) ; off-sheet DDR3_A4
DDR3_A5: R6.1 U2.P2(A5) ; off-sheet DDR3_A5
DDR3_A6: R7.1 U2.R8(A6) ; off-sheet DDR3_A6
DDR3_A7: R8.1 U2.R2(A7) ; off-sheet DDR3_A7
DDR3_A8: R9.1 U2.T8(A8) ; off-sheet DDR3_A8
DDR3_A9: R10.1 U2.R3(A9) ; off-sheet DDR3_A9
DDR3_A10: R11.1 U2.L7(A10/AP) ; off-sheet DDR3_A10
DDR3_A11: R12.1 U2.R7(A11) ; off-sheet DDR3_A11
DDR3_A12: R13.1 U2.N7(A12/BC#) ; off-sheet DDR3_A12
DDR3_A13: R14.1 U2.T3(A13) ; off-sheet DDR3_A13
DDR3_BA0: R15.1 U2.M2(BA0) ; off-sheet DDR3_BA0
DDR3_BA1: R16.1 U2.N8(BA1) ; off-sheet DDR3_BA1
DDR3_BA2: R17.1 U2.M3(BA2) ; off-sheet DDR3_BA2
DDR3_CAS: R22.1 U2.K3(~{CAS}) ; off-sheet DDR3_CAS
DDR3_CK_N: R27.1 U2.K7(~{CK}) ; off-sheet DDR3_CK_N
DDR3_CK_P: R26.2 U2.J7(CK) ; off-sheet DDR3_CK_P
DDR3_CKE: R19.1 U2.K9(CKE) ; off-sheet DDR3_CKE
DDR3_CS: R20.1 R29.1 U2.L2(~{CS}) ; off-sheet DDR3_CS
DDR3_DQ0: U2.E3(DQ0) ; off-sheet DDR3_DQ0
DDR3_DQ1: U2.F7(DQ1) ; off-sheet DDR3_DQ1
DDR3_DQ2: U2.F2(DQ2) ; off-sheet DDR3_DQ2
DDR3_DQ3: U2.F8(DQ3) ; off-sheet DDR3_DQ3
DDR3_DQ4: U2.H3(DQ4) ; off-sheet DDR3_DQ4
DDR3_DQ5: U2.H8(DQ5) ; off-sheet DDR3_DQ5
DDR3_DQ6: U2.G2(DQ6) ; off-sheet DDR3_DQ6
DDR3_DQ7: U2.H7(DQ7) ; off-sheet DDR3_DQ7
DDR3_DQ8: U2.D7(DQ8) ; off-sheet DDR3_DQ8
DDR3_DQ9: U2.C3(DQ9) ; off-sheet DDR3_DQ9
DDR3_DQ10: U2.C8(DQ10) ; off-sheet DDR3_DQ10
DDR3_DQ11: U2.C2(DQ11) ; off-sheet DDR3_DQ11
DDR3_DQ12: U2.A7(DQ12) ; off-sheet DDR3_DQ12
DDR3_DQ13: U2.A2(DQ13) ; off-sheet DDR3_DQ13
DDR3_DQ14: U2.B8(DQ14) ; off-sheet DDR3_DQ14
DDR3_DQ15: U2.A3(DQ15) ; off-sheet DDR3_DQ15
DDR3_LDM: U2.E7(LDM) ; off-sheet DDR3_LDM
DDR3_LDQS_N: U2.G3(~{LDQS}) ; off-sheet DDR3_LDQS_N
DDR3_LDQS_P: U2.F3(LDQS) ; off-sheet DDR3_LDQS_P
DDR3_ODT: R24.1 U2.K1(ODT) ; off-sheet DDR3_ODT
DDR3_RAS: R21.1 U2.J3(~{RAS}) ; off-sheet DDR3_RAS
DDR3_RESET: R25.2 U2.T2(~{RESET}) ; off-sheet DDR3_RESET
DDR3_UDM: U2.D3(UDM) ; off-sheet DDR3_UDM
DDR3_UDQS_N: U2.B7(~{UDQS}) ; off-sheet DDR3_UDQS_N
DDR3_UDQS_P: U2.C7(UDQS) ; off-sheet DDR3_UDQS_P
DDR3_WE: R23.1 U2.L3(~{WE}) ; off-sheet DDR3_WE
PG_1V5: U3.7(EN) ; off-sheet PG_1V5
PG_DDR3: U3.9(PGOOD) ; off-sheet PG_DDR3
NetC26_2: C26.2 R31.2 R32.1 U3.1(REFIN)
NetR26_1: R26.1 R27.2
NetR28_1: R28.1 U2.L8(ZQ)

Not connected (* = marked no-connect by the designer): U2 J1(NC)* J9(NC)* L1(NC)* L9(NC)* M7(NC)* T7(NC)*

### Layout directives
differential pair: DDR3_CK_N, DDR3_CK_P, DDR3_LDQS_N, DDR3_LDQS_P, DDR3_UDQS_N, DDR3_UDQS_P
net class DDR3_40R: DDR3_A0, DDR3_A1, DDR3_A2, DDR3_A3, DDR3_A4, DDR3_A5, DDR3_A6, DDR3_A7, DDR3_A8, DDR3_A9, DDR3_A10, DDR3_A11, DDR3_A12, DDR3_A13, DDR3_BA0, DDR3_BA1, DDR3_BA2, DDR3_CAS, DDR3_CKE, DDR3_CS, DDR3_DQ0, DDR3_DQ1, DDR3_DQ2, DDR3_DQ3, DDR3_DQ4, DDR3_DQ5, DDR3_DQ6, DDR3_DQ7, DDR3_DQ8, DDR3_DQ9, DDR3_DQ10, DDR3_DQ11, DDR3_DQ12, DDR3_DQ13, DDR3_DQ14, DDR3_DQ15, DDR3_LDM, DDR3_ODT, DDR3_RAS, DDR3_UDM, DDR3_WE
net class DDR3_80R: DDR3_CK_N, DDR3_CK_P, DDR3_LDQS_N, DDR3_LDQS_P, DDR3_UDQS_N, DDR3_UDQS_P

### Notes on the sheet
- FPGA
- DECOUPLAGE
- 4
- DDR3 - tps51200.pdf
  P.22
- -Ligne de transmission de 40R
  -Resistance paralèle sur la ligne de transmission de 40.2Ohms
  -Clock en pair différentiel 80R
  -Découplage il y 18 pins donc on peut en mettre 18 condensateurs
  -Dans un cours on s'est fait dire que c'est un condensateur par résistance de VTT
- Sheet Name
- Project Title
- Global Project
- Size
- Group
- Revision
- Date
- Sheet
- of
- Filename
- Designers
- (in symbol MEM_DDR3_MT41J128M16JT-125:K TR) DDR3 SDRAM

### Library data of the parts
C16 C153 = CAP - 0603: Mfg Part Number: C0603C105K8RAC; Precision: 10%; Current: *; CreatedBy: Jonathan Bouchard; Power: *
C17-C24 C29 C39 C42-C45 C49 C50 C171-C176 C181-C183 = CAP - 0402: as C99 on sheet S7CAS-PLEIADES-CARTE-MERE_P01_CAN; Current: *; CreatedBy: Jonathan Bouchard; Power: *; Precision: 10%; Part Number #1: CL05B104KA5NNNC
C26 = CAP - 0805: 1000 pF ±10% 10V Ceramic Capacitor X7R 0805 (2012 Metric); Mfg Part Number: C0805C102K8RACTU; Current: *; CreatedBy: Jonathan Bouchard; Power: *; Precision: 10%; Part Number #1: C0805C102K8RACTU
C27 C28 C30-C32 = CAP - 0805: 10 µF ±10% 25V Ceramic Capacitor X5R 0805 (2012 Metric); Mfg Part Number: CL21A106KAYNNNE; Mfg: Samsung Electro-Mechanics; Current: *; CreatedBy: Jonathan Bouchard; Power: *; Precision: 10%; Part Number #1: CL21A106KAYNNNE
C57 C58 C60 C74 C75 C152 C154 C155 C158-C164 C167 C170 = CAP - 0402: as C165 on sheet S7CAS-PLEIADES-CARTE-MERE_P01_CAN; Current: *; CreatedBy: Jonathan Bouchard; Power: *
C117 = CAP - 0805: 4.7 µF ±10% 50V Ceramic Capacitor X5R 0805 (2012 Metric); Mfg Part Number: GRT21BR61H475KE13L; Mfg: Murata Electronics; Current: *; CreatedBy: Jonathan Bouchard; Power: *; Precision: 10%
R1-R17 R19-R24 R26 R27 = RES - 0402: 40.2 Ohms ±1% 0.1W, 1/10W Chip Resistor 0402 (1005 Metric) Automotive AEC-Q200 Thick Film; Mfg Part Number: CRCW040240R2FKED; Voltage: 75V; Power: 1/16W; Current: *; CreatedBy: Jonathan Bouchard; Package: 0402; Part Number #1: CRCW040240R2FKED
R25 = RES - 0402: 4.7 kOhms ±1% 0.063W, 1/16W Chip Resistor 0402 (1005 Metric) Moisture Resistant Thick Film; Mfg Part Number: RC0402FR-074K7L; Voltage: 75V; Current: *; CreatedBy: Jonathan Bouchard; Power: 1/16W; Package: 0402; Part Number #1: RC0402FR-074K7L
R28 = RES - 0402: 240 Ohms ±1% 0.1W, 1/10W Chip Resistor 0402 (1005 Metric) Automotive AEC-Q200 Thick Film; Mfg Part Number: ERJ-2RKF2400X; Voltage: 50V; Current: *; CreatedBy: Jonathan Bouchard; Power: 1/10W; Package: 0402; Part Number #1: ERJ-2RKF2400X
R29 = RES - 0402: 100 Ohms ±1% 0.1W, 1/10W Chip Resistor 0402 (1005 Metric) Automotive AEC-Q200 Thick Film; Mfg Part Number: RK73H1ETTP1000F; Voltage: 75V; Current: *; CreatedBy: Jonathan Bouchard; Power: 1/10W; Package: 0402; Part Number #1: RK73H1ETTP1000F
R31 R32 = RES - 0402: 10 kOhms ±1% 0.063W, 1/16W Chip Resistor 0402 (1005 Metric) Automotive AEC-Q200 Thick Film; Mfg Part Number: RMCF0402FT10K0; Voltage: 75V; Current: *; CreatedBy: Jonathan Bouchard; Power: 1/16W; Part Number #1: RMCF0402FT10K0
U2 = MEM_DDR3_MT41J128M16JT-125:K TR: MEM - DDR3 SDRAM 2GBIT 800MHZ - TFBGA-96; Voltage: 1.425 V ~ 1.575 V; Mfg: Micrel; Current: *; Power: *; Mfg Part Number: MT41J128M16JT-125; HelpURL: http://www.micron.com/~/media/Documents/Products/Data%20Sheet/DRAM/DDR3/2Gb_DDR3_SDRAM.pdf; CreatedBy: Jonathan Bouchard; Temperature: 0°C ~ 95°C (TC); Value: *; Precision: *; Package: TFBGA-96; Supplier 1: Digikey; Supplier Part Number 1: 557-1611-1-ND; Part Number #1: MT41J128M16JT-125
U3 = REG_PMIC_TPS51200DRCT: REG - DDR TERMINATION/REF REG - 10-VFDFN; Manufacturer #1: Texas Instruments; Value: DDR, DDR2, DDR3(L), DDR4; Voltage Rating: 2.375V ~ 3.5V; Current Rating: Source: 3A~4.5A, Sink: 3.5A~5.5A; GRAMS Lib Spec: 2.8; Magnetic Material: Unknown; Polarized: Yes; Tolerance: *; Power Max: *; HelpURL: http://www.ti.com/lit/ds/symlink/tps51200.pdf; CreatedBy/Date: Joel Lemay 2019-03-19; VerifiedBy: Nicolas V. (2019-05-31); Temperature: -40°C ~ 85°C; Package: 10-VFDFN; Manufacturer #2: *; Part Number #2: *; Part Number #1: TPS51200DRCT; Supplier 1: Digi-Key; Supplier Part Number 1: 296-23830-1-ND; Cryo: UNKNOWN; Mfg Part Number: TPS51200DRCT

## Sheet S7CAS-PLEIADES-CARTE-MERE_P01_MOTORS.SchDoc
size Tabloid; DocumentNumber: 9; SheetNumber: 9; SheetTotal: 17; Sheet_Name: MOTORS; Size: 11x17
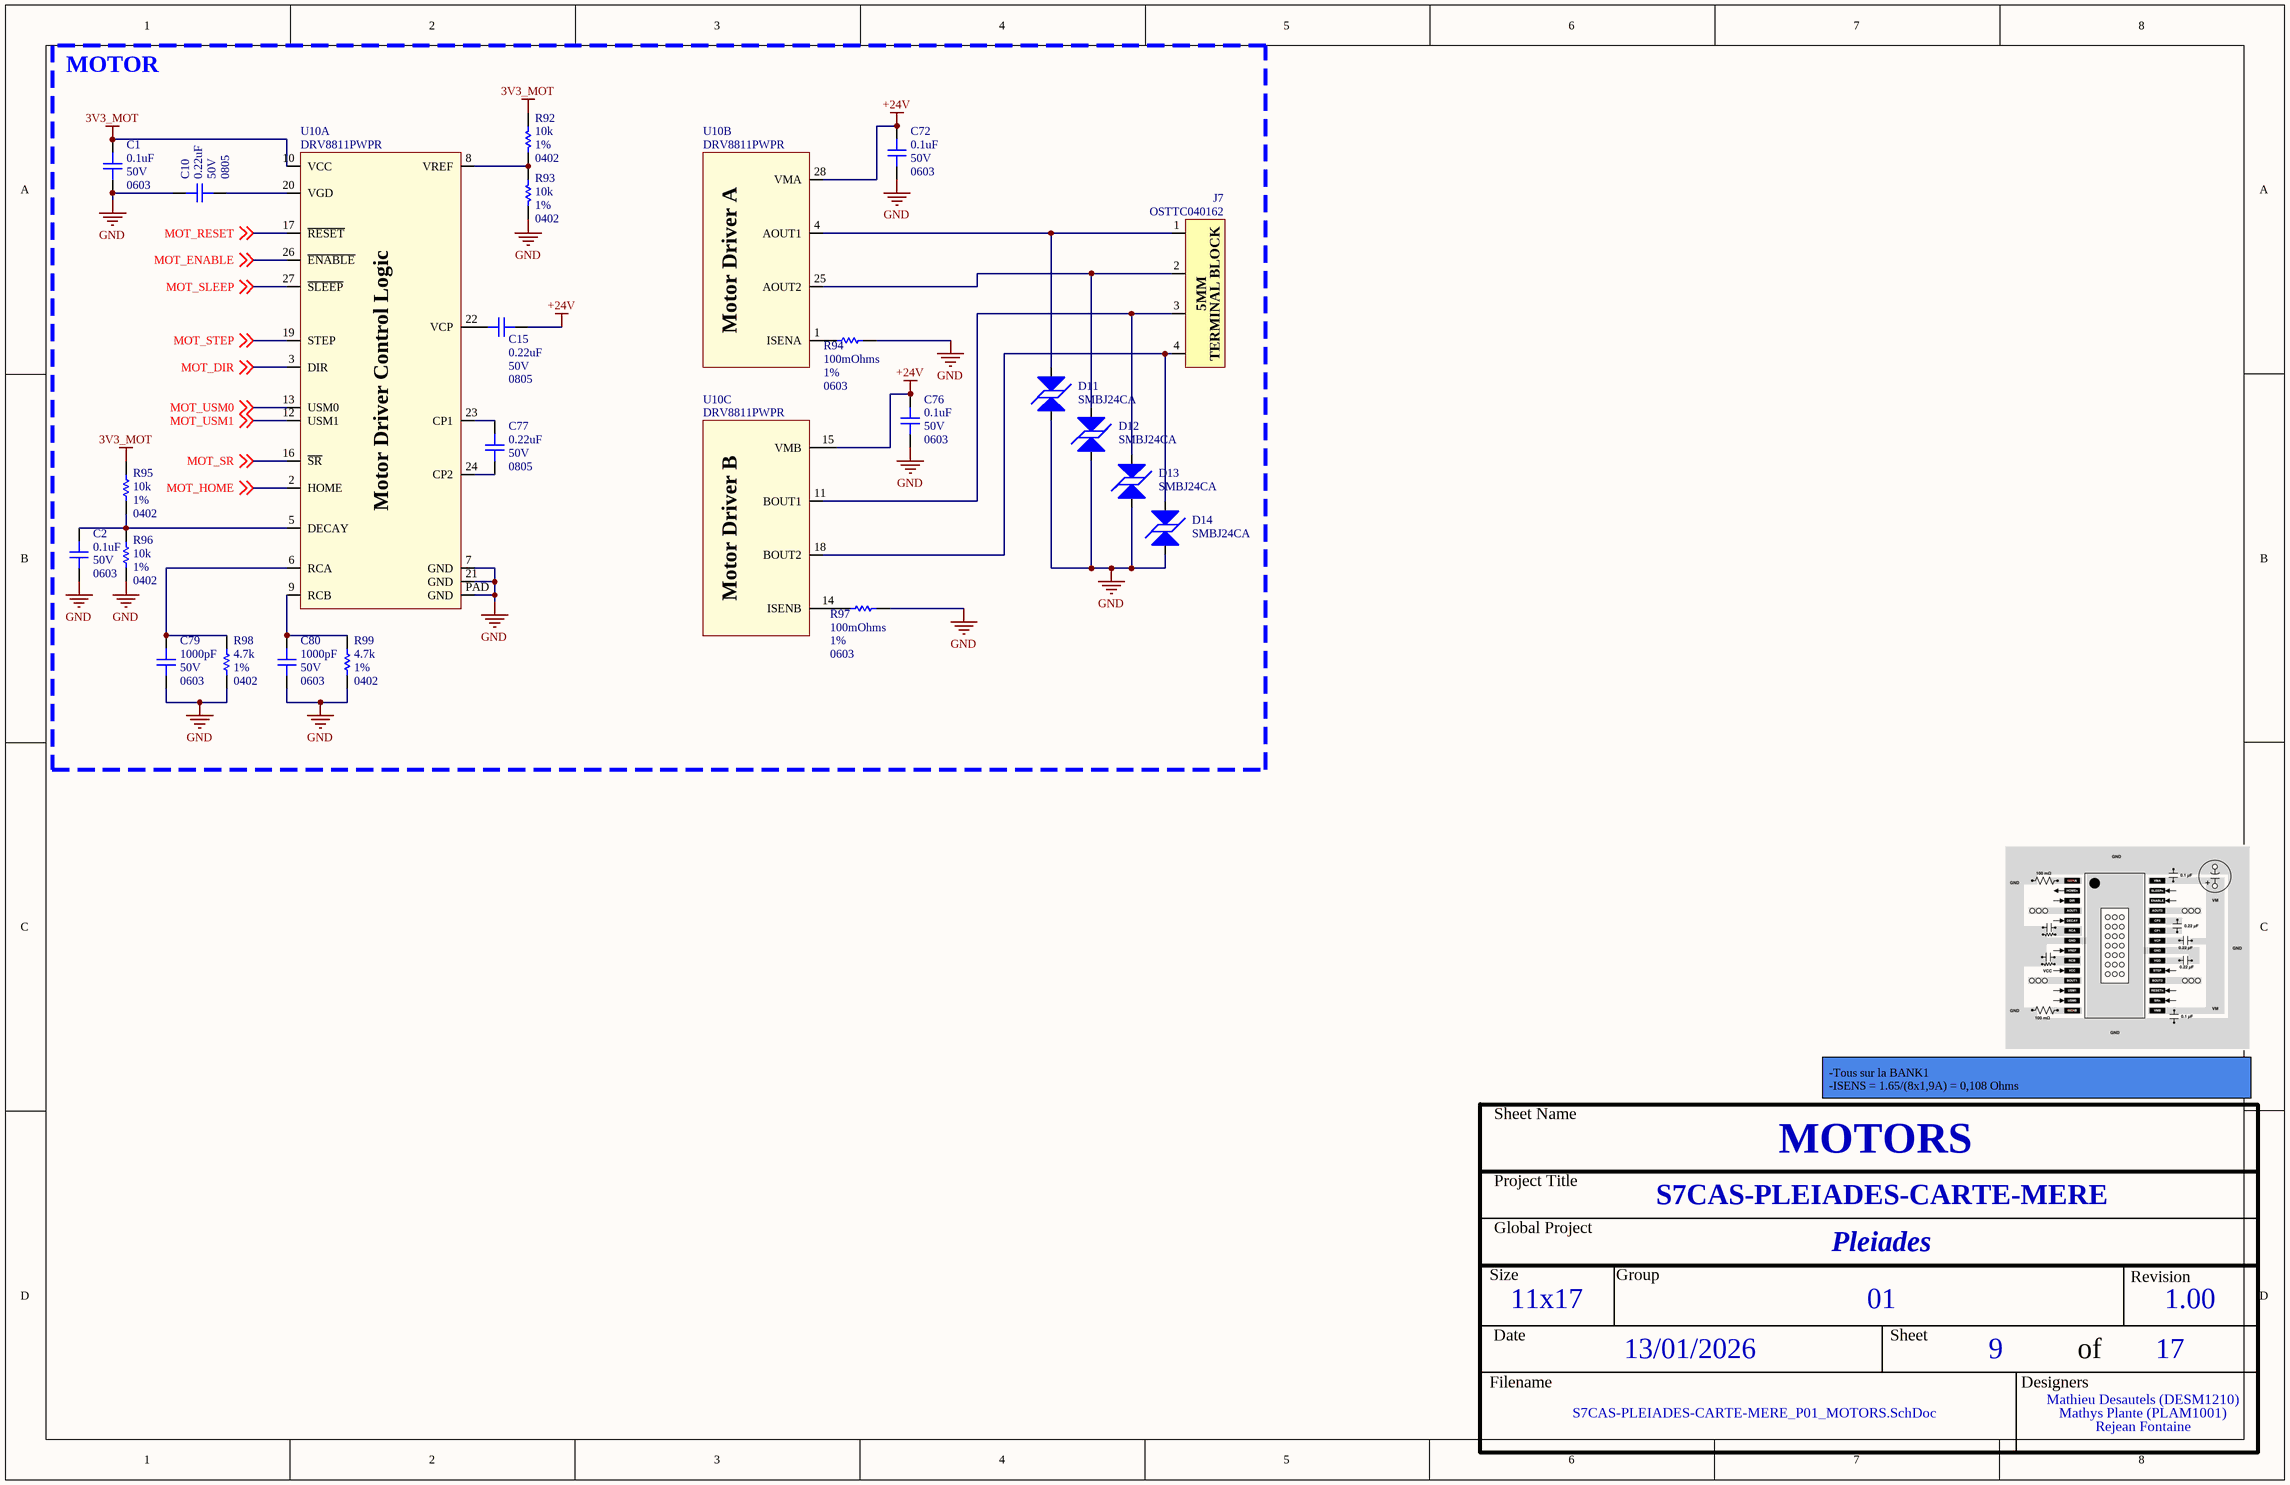
[diagram p8: S7CAS-PLEIADES-CARTE-MERE_P01_MOTORS.SchDoc]

### Parts
C1  value 0.1uF  Voltage: 50V  Package: 0603  [CAP_0603]  (hidden comment: CAP - 0603)
C2  value 0.1uF  Voltage: 50V  Package: 0603  [CAP_0603]  (hidden comment: CAP - 0603)
C10  value 0.22uF  Voltage: 50V  Package: 0805  [CAP_0805]  (hidden comment: CAP - 0805)
C15  value 0.22uF  Voltage: 50V  Package: 0805  [CAP_0805]  (hidden comment: CAP - 0805)
C72  value 0.1uF  Voltage: 50V  Package: 0603  [CAP_0603]  (hidden comment: CAP - 0603)
C76  value 0.1uF  Voltage: 50V  Package: 0603  [CAP_0603]  (hidden comment: CAP - 0603)
C77  value 0.22uF  Voltage: 50V  Package: 0805  [CAP_0805]  (hidden comment: CAP - 0805)
C79  value 1000pF  Voltage: 50V  Package: 0603  [CAP_0603]  (hidden comment: CAP - 0603)
C80  value 1000pF  Voltage: 50V  Package: 0603  [CAP_0603]  (hidden comment: CAP - 0603)
D11  SMBJ24CA  [TVS_PWR_SMBJ36CA]
D12  SMBJ24CA  [TVS_PWR_SMBJ36CA]
D13  SMBJ24CA  [TVS_PWR_SMBJ36CA]
D14  SMBJ24CA  [TVS_PWR_SMBJ36CA]
J7  OSTTC040162  [CONN_TERMINAL_OSTTA040161]
R92  value 10k  Package: 0402  Precision: 1%  [RES_0402]  (hidden comment: RES - 0402)
R93  value 10k  Package: 0402  Precision: 1%  [RES_0402]  (hidden comment: RES - 0402)
R94  value 100mOhms  Package: 0603  Precision: 1%  [RES_0603]  (hidden comment: RES - 0603)
R95  value 10k  Package: 0402  Precision: 1%  [RES_0402]  (hidden comment: RES - 0402)
R96  value 10k  Package: 0402  Precision: 1%  [RES_0402]  (hidden comment: RES - 0402)
R97  value 100mOhms  Package: 0603  Precision: 1%  [RES_0603]  (hidden comment: RES - 0603)
R98  value 4.7k  Package: 0402  Precision: 1%  [RES_0402]  (hidden comment: RES - 0402)
R99  value 4.7k  Package: 0402  Precision: 1%  [RES_0402]  (hidden comment: RES - 0402)
U10  DRV8811PWPR  [POW_MOTOR_DRV8811PWPR]  (parts A,B,C of 3)

### Blocks framed on the sheet
MOTOR: C1 C2 C10 C15 C72 C76 C77 C79 C80 D11-D14 J7 R92-R99 U10

### Nets
3V3_MOT: C1.2 R92.2 R95.2 U10.10(VCC)  [project net VDD_3V3]
+24V: C15.1 C72.2 C76.2 U10.15(VMB) U10.28(VMA)
GND: C1.1 C2.1 C10.2 C72.1 C76.1 C79.1 C80.1 D11.2 D12.2 D13.2 D14.2 R93.1 R94.1 R96.1 R97.1 R98.1 R99.1 U10.7(GND) U10.21(GND) U10.PAD(GND)
MOT_DIR: U10.3(DIR) ; off-sheet MOT_DIR
MOT_ENABLE: U10.26(~{ENABLE}) ; off-sheet MOT_ENABLE
MOT_HOME: U10.2(HOME) ; off-sheet MOT_HOME
MOT_RESET: U10.17(~{RESET}) ; off-sheet MOT_RESET
MOT_SLEEP: U10.27(~{SLEEP}) ; off-sheet MOT_SLEEP
MOT_SR: U10.16(~{SR}) ; off-sheet MOT_SR
MOT_STEP: U10.19(STEP) ; off-sheet MOT_STEP
MOT_USM0: U10.13(USM0) ; off-sheet MOT_USM0
MOT_USM1: U10.12(USM1) ; off-sheet MOT_USM1
NetC2_2: C2.2 R95.1 R96.2 U10.5(DECAY)
NetC10_1: C10.1 U10.20(VGD)
NetC15_2: C15.2 U10.22(VCP)
NetC77_1: C77.1 U10.24(CP2)
NetC77_2: C77.2 U10.23(CP1)
NetC79_2: C79.2 R98.2 U10.6(RCA)
NetC80_2: C80.2 R99.2 U10.9(RCB)
NetD11_1: D11.1 J7.1 U10.4(AOUT1)
NetD12_1: D12.1 J7.2 U10.25(AOUT2)
NetD13_1: D13.1 J7.3 U10.11(BOUT1)
NetD14_1: D14.1 J7.4 U10.18(BOUT2)
NetR92_1: R92.1 R93.2 U10.8(VREF)
NetR94_2: R94.2 U10.1(ISENA)
NetR97_2: R97.2 U10.14(ISENB)

### Notes on the sheet
- -Tous sur la BANK1
  -ISENS = 1.65/(8x1,9A) = 0,108 Ohms
- Sheet Name
- Project Title
- Global Project
- Size
- Group
- Revision
- Date
- Sheet
- of
- Filename
- Designers
- (in symbol CONN_TERMINAL_OSTTC040162) 5MM; TERMINAL BLOCK
- (in symbol POW_MOTOR_DRV8811PWPR, part A) Motor Driver Control Logic
- (in symbol POW_MOTOR_DRV8811PWPR, part B) Motor Driver A
- (in symbol POW_MOTOR_DRV8811PWPR, part C) Motor Driver B

### Library data of the parts
C1 C2 C72 C76 = CAP - 0603: 0.1 µF ±10% 50V Ceramic Capacitor X7R 0603 (1608 Metric); Mfg Part Number: C0603C104K5RACTU; Mfg: KEMET; Current: *; CreatedBy: Jonathan Bouchard; Power: *; Precision: 10%
C10 C15 C77 = CAP - 0805: 0.22 µF ±10% 50V Ceramic Capacitor X7R 0805 (2012 Metric); Mfg Part Number: C0805C224K5RACTU; Current: *; CreatedBy: Jonathan Bouchard; Power: *; Precision: 10%
C79 C80 = CAP - 0603: 1000 pF ±10% 50V Ceramic Capacitor X7R 0603 (1608 Metric); Mfg Part Number: C0603C102K5RACTU; Mfg: KEMET; Current: *; CreatedBy: Jonathan Bouchard; Power: *; Precision: 10%
D11-D14 = TVS_PWR_SMBJ24CA: TVS - 24V 26.7V 600W - DO214AA; Manufacturer #1: Littelfuse Inc.; Value: Vbr = 26.7V -  Clamp = 38.9V; Voltage Rating: 24V Standoff; Current Rating: 15.5A; GRAMS Lib Spec: 2.8; Magnetic Material: UNKNOWN; Polarized: NO; Tolerance: *; Power Max: 600W; HelpURL: http://www.littelfuse.com/~/media/electronics/datasheets/tvs_diodes/littelfuse_tvs_diode_smbj_datasheet.pdf.pdf; CreatedBy/Date: Arnaud Samson - 06/07/18; VerifiedBy: Jonathan Bouchard - 2018-07-13; Temperature: -65°C ~ 150°C (TJ); Package: DO214AA; Manufacturer #2: *; Note: *; Assembly Type: SMD; Part Number #2: *; Part Number #1: SMBJ24CA; Supplier 1: Digi-Key; Supplier Part Number 1: SMBJ24CALFCT-ND; Cryo: UNKNOWN
J7 = CONN_TERMINAL_OSTTC040162: CONN -  TERMINAL BLOCK 4POS 5MM - TH; Mfg: On Shore Technology Inc.; Voltage: *; Current: *; Power: *; Mfg Part Number: OSTTC040162; HelpURL: http://www.on-shore.com/wp-content/uploads/2015/09/osttcxx0162.pdf; CreatedBy: Jonathan Bouchard; Temperature: -30°C ~ 105°C; Value: *; Precision: *; Package: TH-4; Supplier 1: Digikey; Supplier Part Number 1: ED2602-ND
R92 R93 R95 R96 = RES - 0402: as R31 on sheet S7CAS-PLEIADES-CARTE-MERE_P01_DDR3; Current: *; CreatedBy: Jonathan Bouchard; Power: 1/16W; Part Number #1: RMCF0402FT10K0
R94 R97 = RES - 0603: 100 mOhms ±1% 0.333W, 1/3W Chip Resistor 0603 (1608 Metric) Automotive AEC-Q200, Current Sense Thick Film; Mfg Part Number: ERJ-3BWFR100V; Mfg: Panasonic Electronic Components; Current: *; CreatedBy: Jonathan Bouchard
R98 R99 = RES - 0402: as R25 on sheet S7CAS-PLEIADES-CARTE-MERE_P01_DDR3; Current: *; CreatedBy: Jonathan Bouchard; Power: 1/16W; Part Number #1: RC0402FR-074K7L
U10 = POW_MOTOR_DRV8811PWPR: POW - STEPPER MOTOR DRIVER - SOP-28; Voltage: 3 V ~ 5.5 V / 8 V ~ 38 V; Mfg: Texas Instrument; Current: *; Power: *; Mfg Part Number: DRV8811PWPR; HelpURL: http://www.ti.com/lit/ds/symlink/drv8811.pdf; CreatedBy: Jonathan Bouchard; Temperature: -40°C ~ 150°C (TJ); Value: *; Precision: *; Package: SOP-28; Supplier 1: Digikey; Supplier Part Number 1: 296-24591-1-ND